# EAGLE schematic ESP32-POV (EAGLE 6.5.0), part 1 of 3
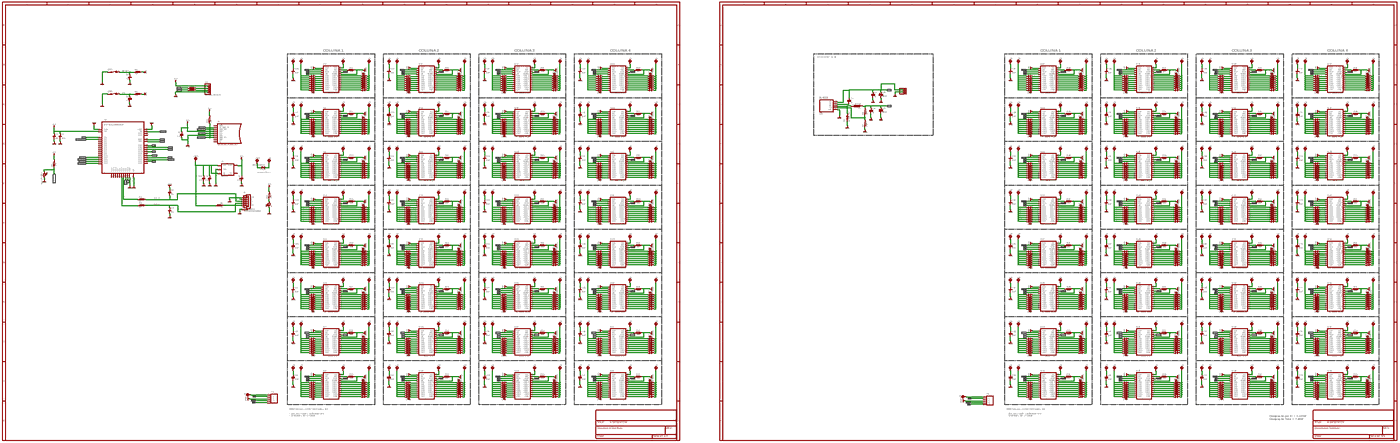
[diagram p0: schematic, sheet 1, overview]
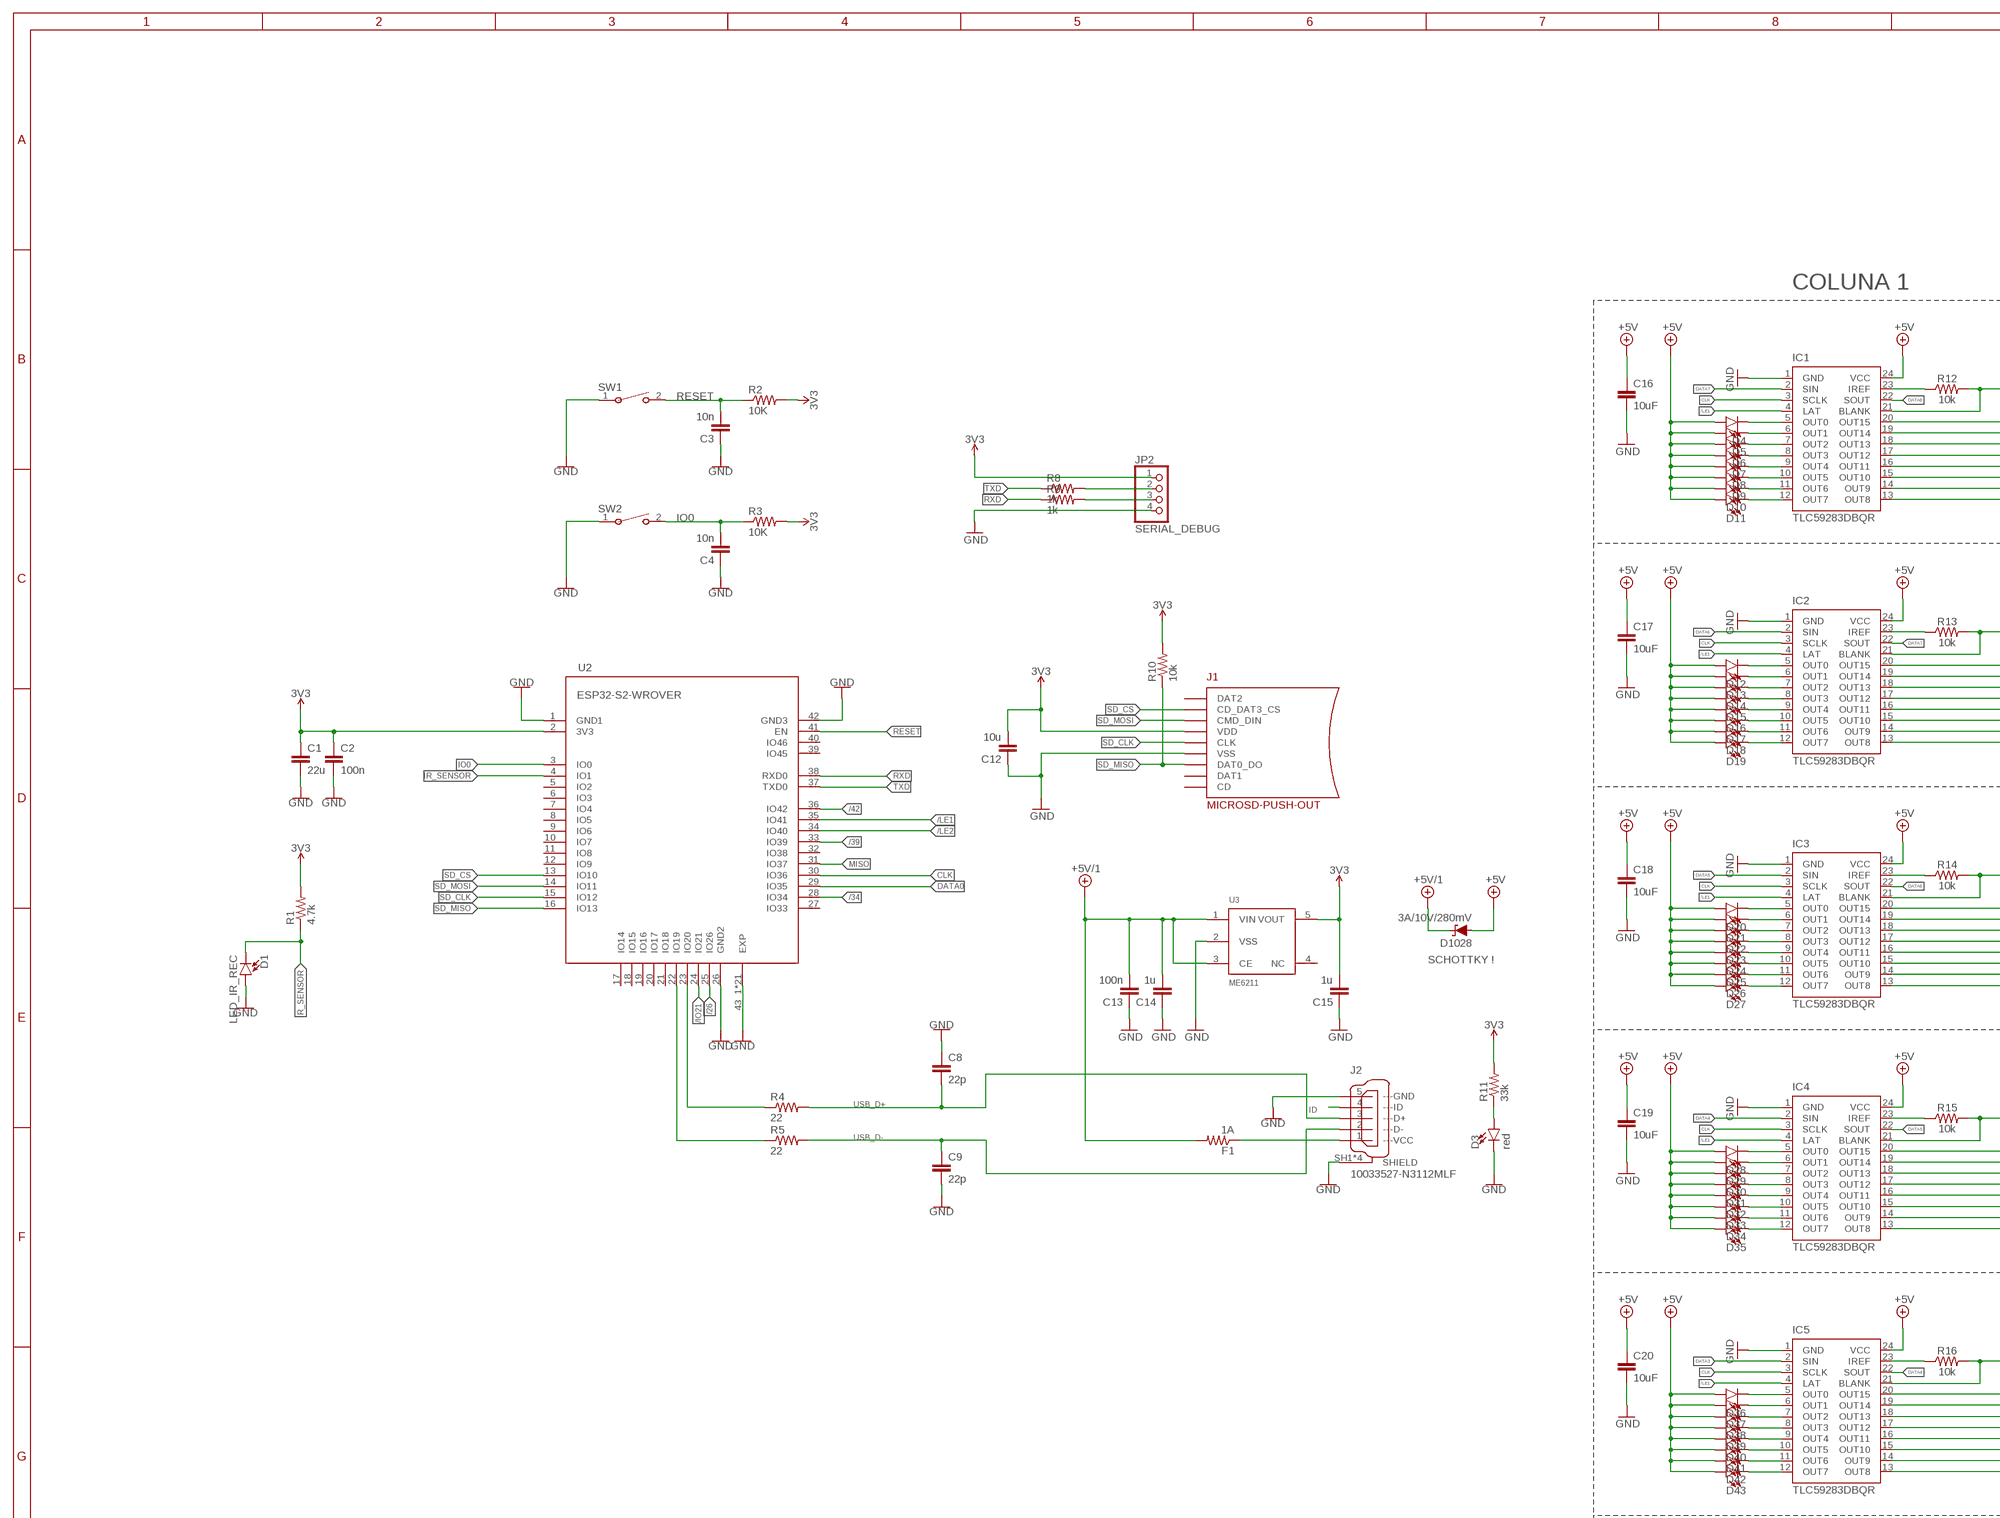
[diagram p1: schematic, sheet 1, part 1 of 8]
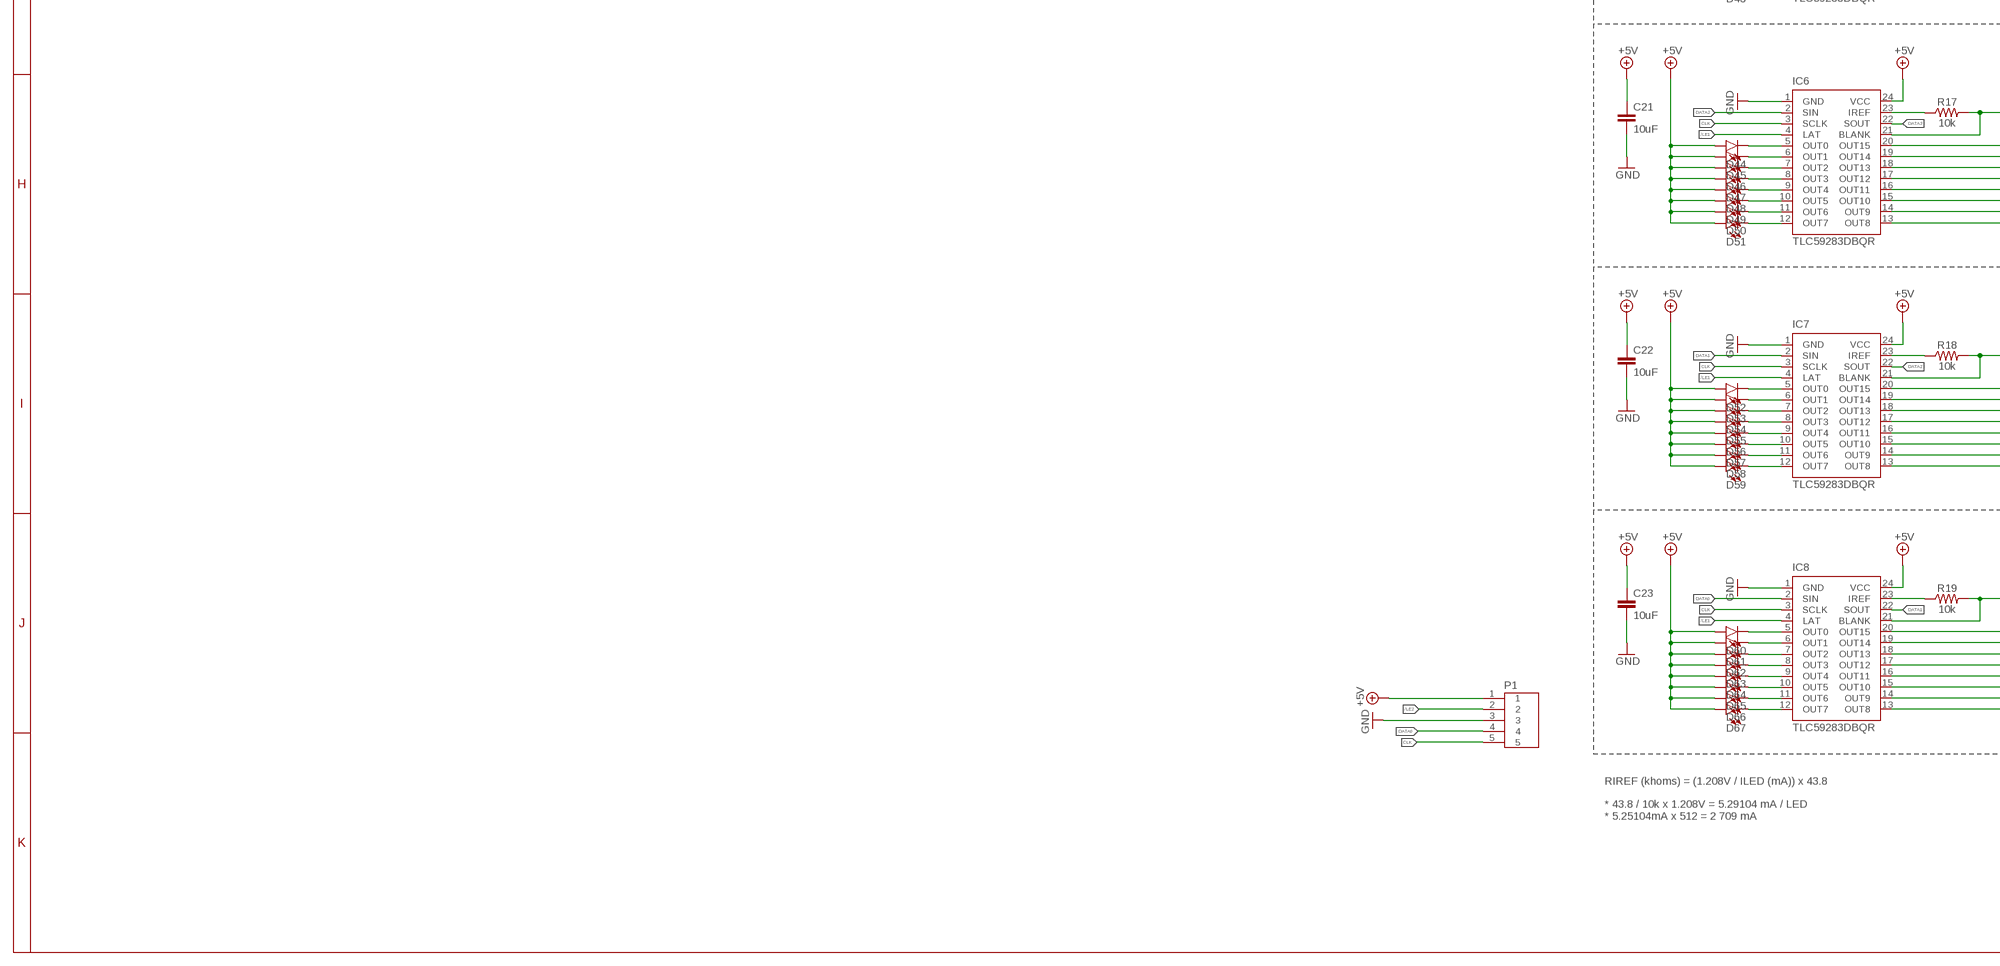
[diagram p2: schematic, sheet 1, part 2 of 8]
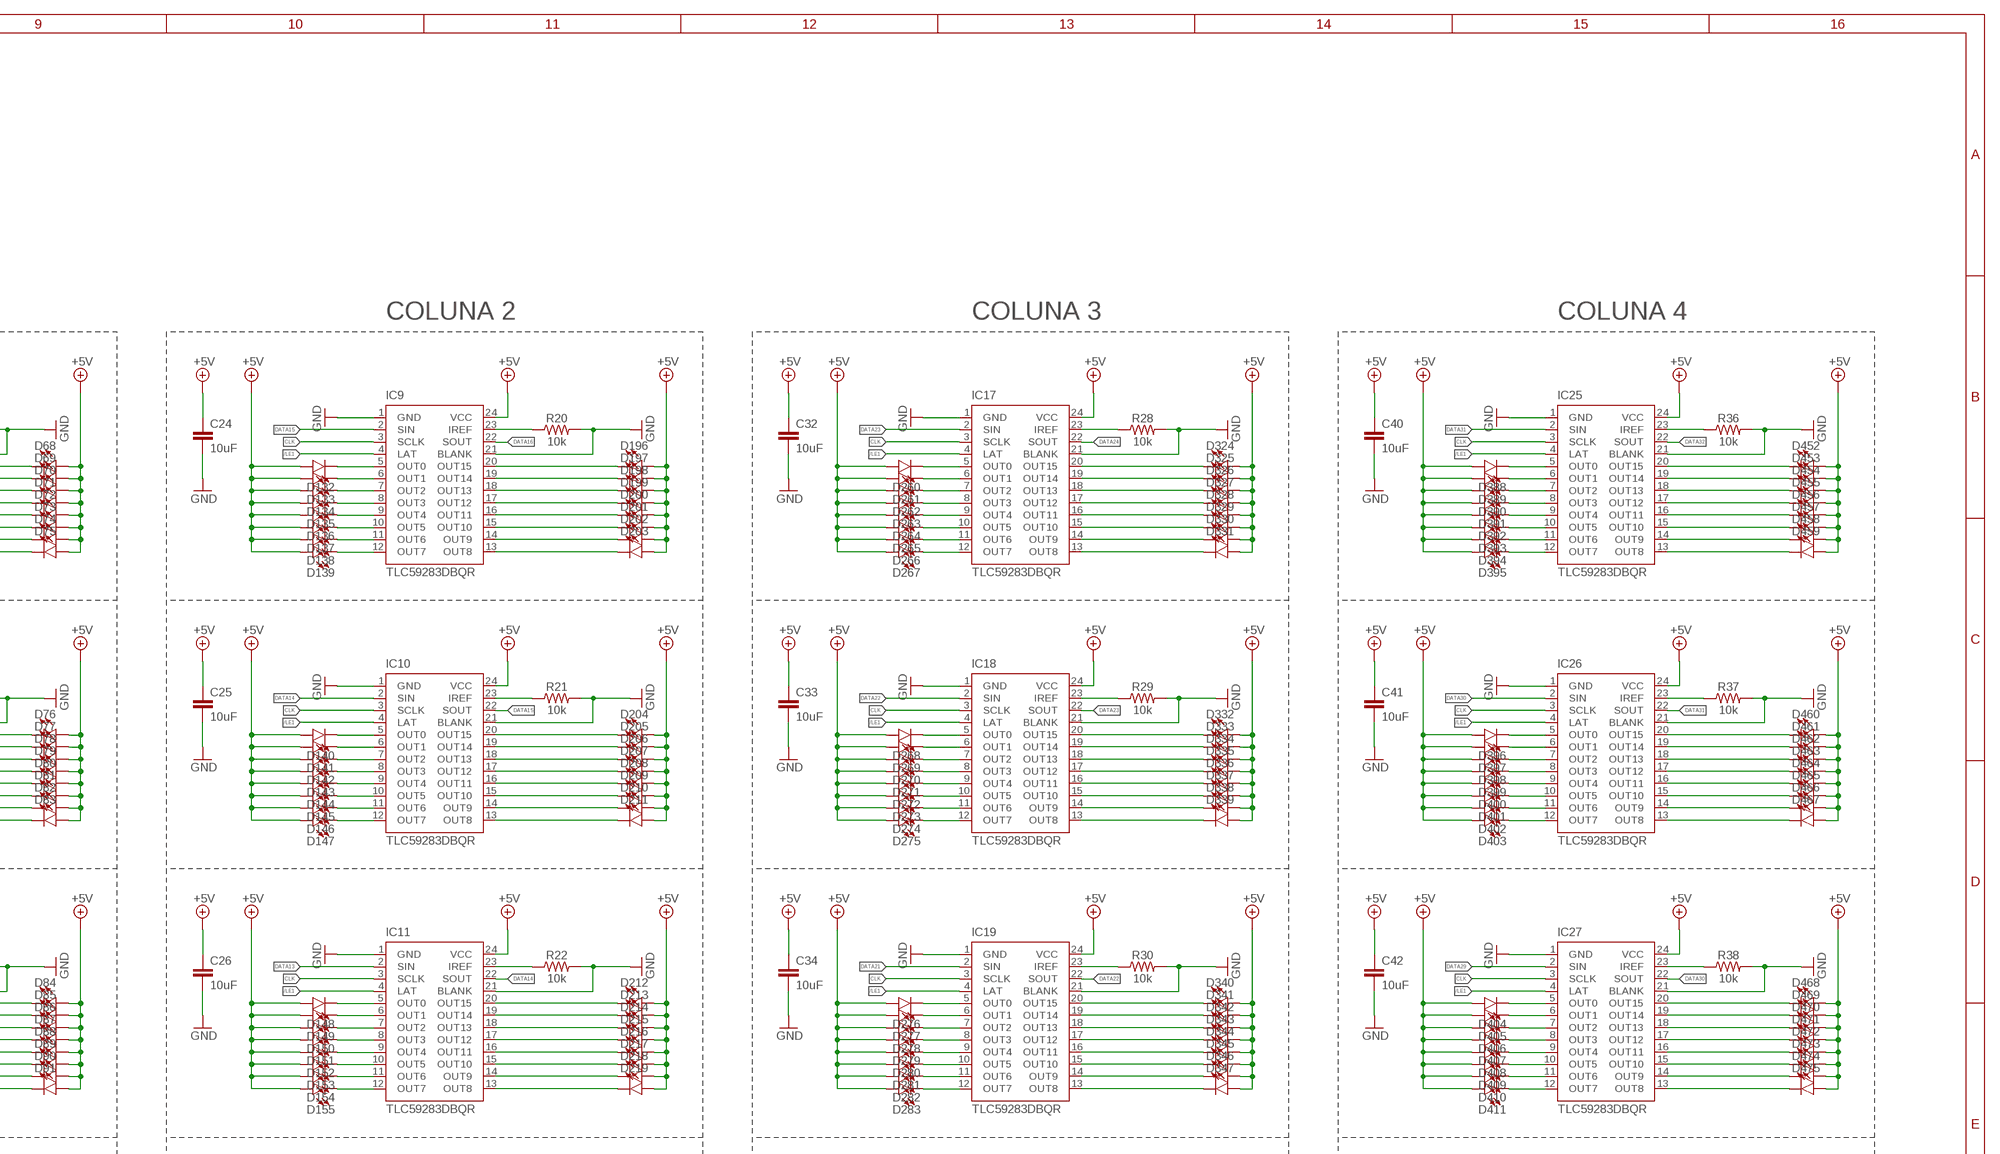
[diagram p3: schematic, sheet 1, part 3 of 8]
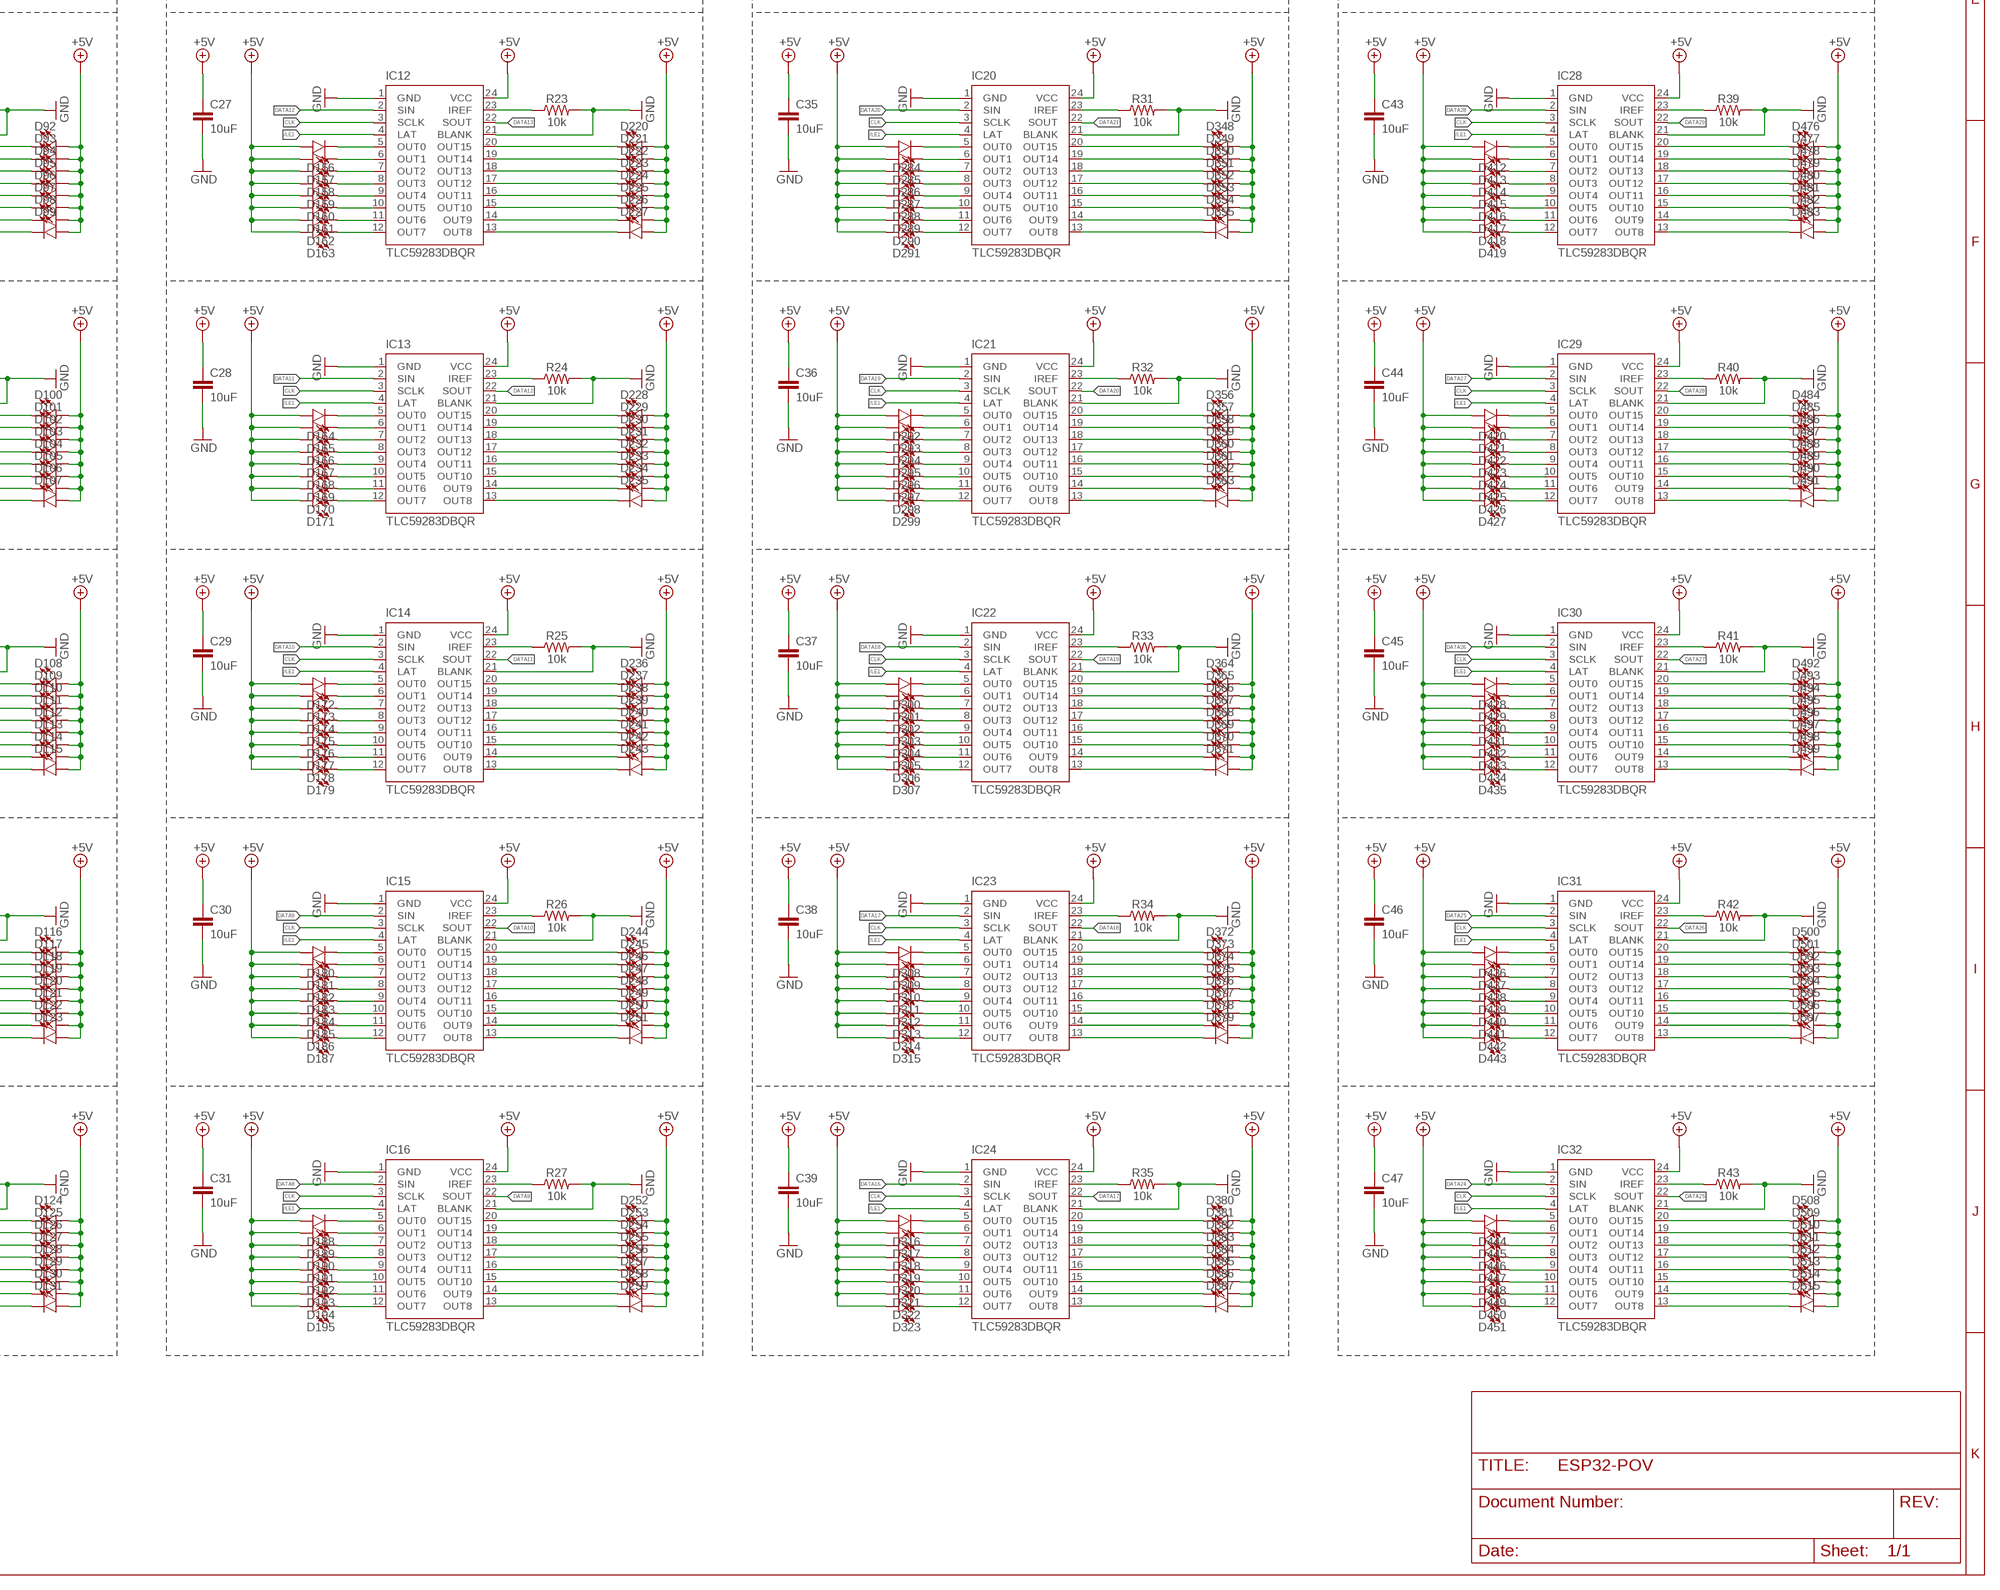
[diagram p4: schematic, sheet 1, part 4 of 8]
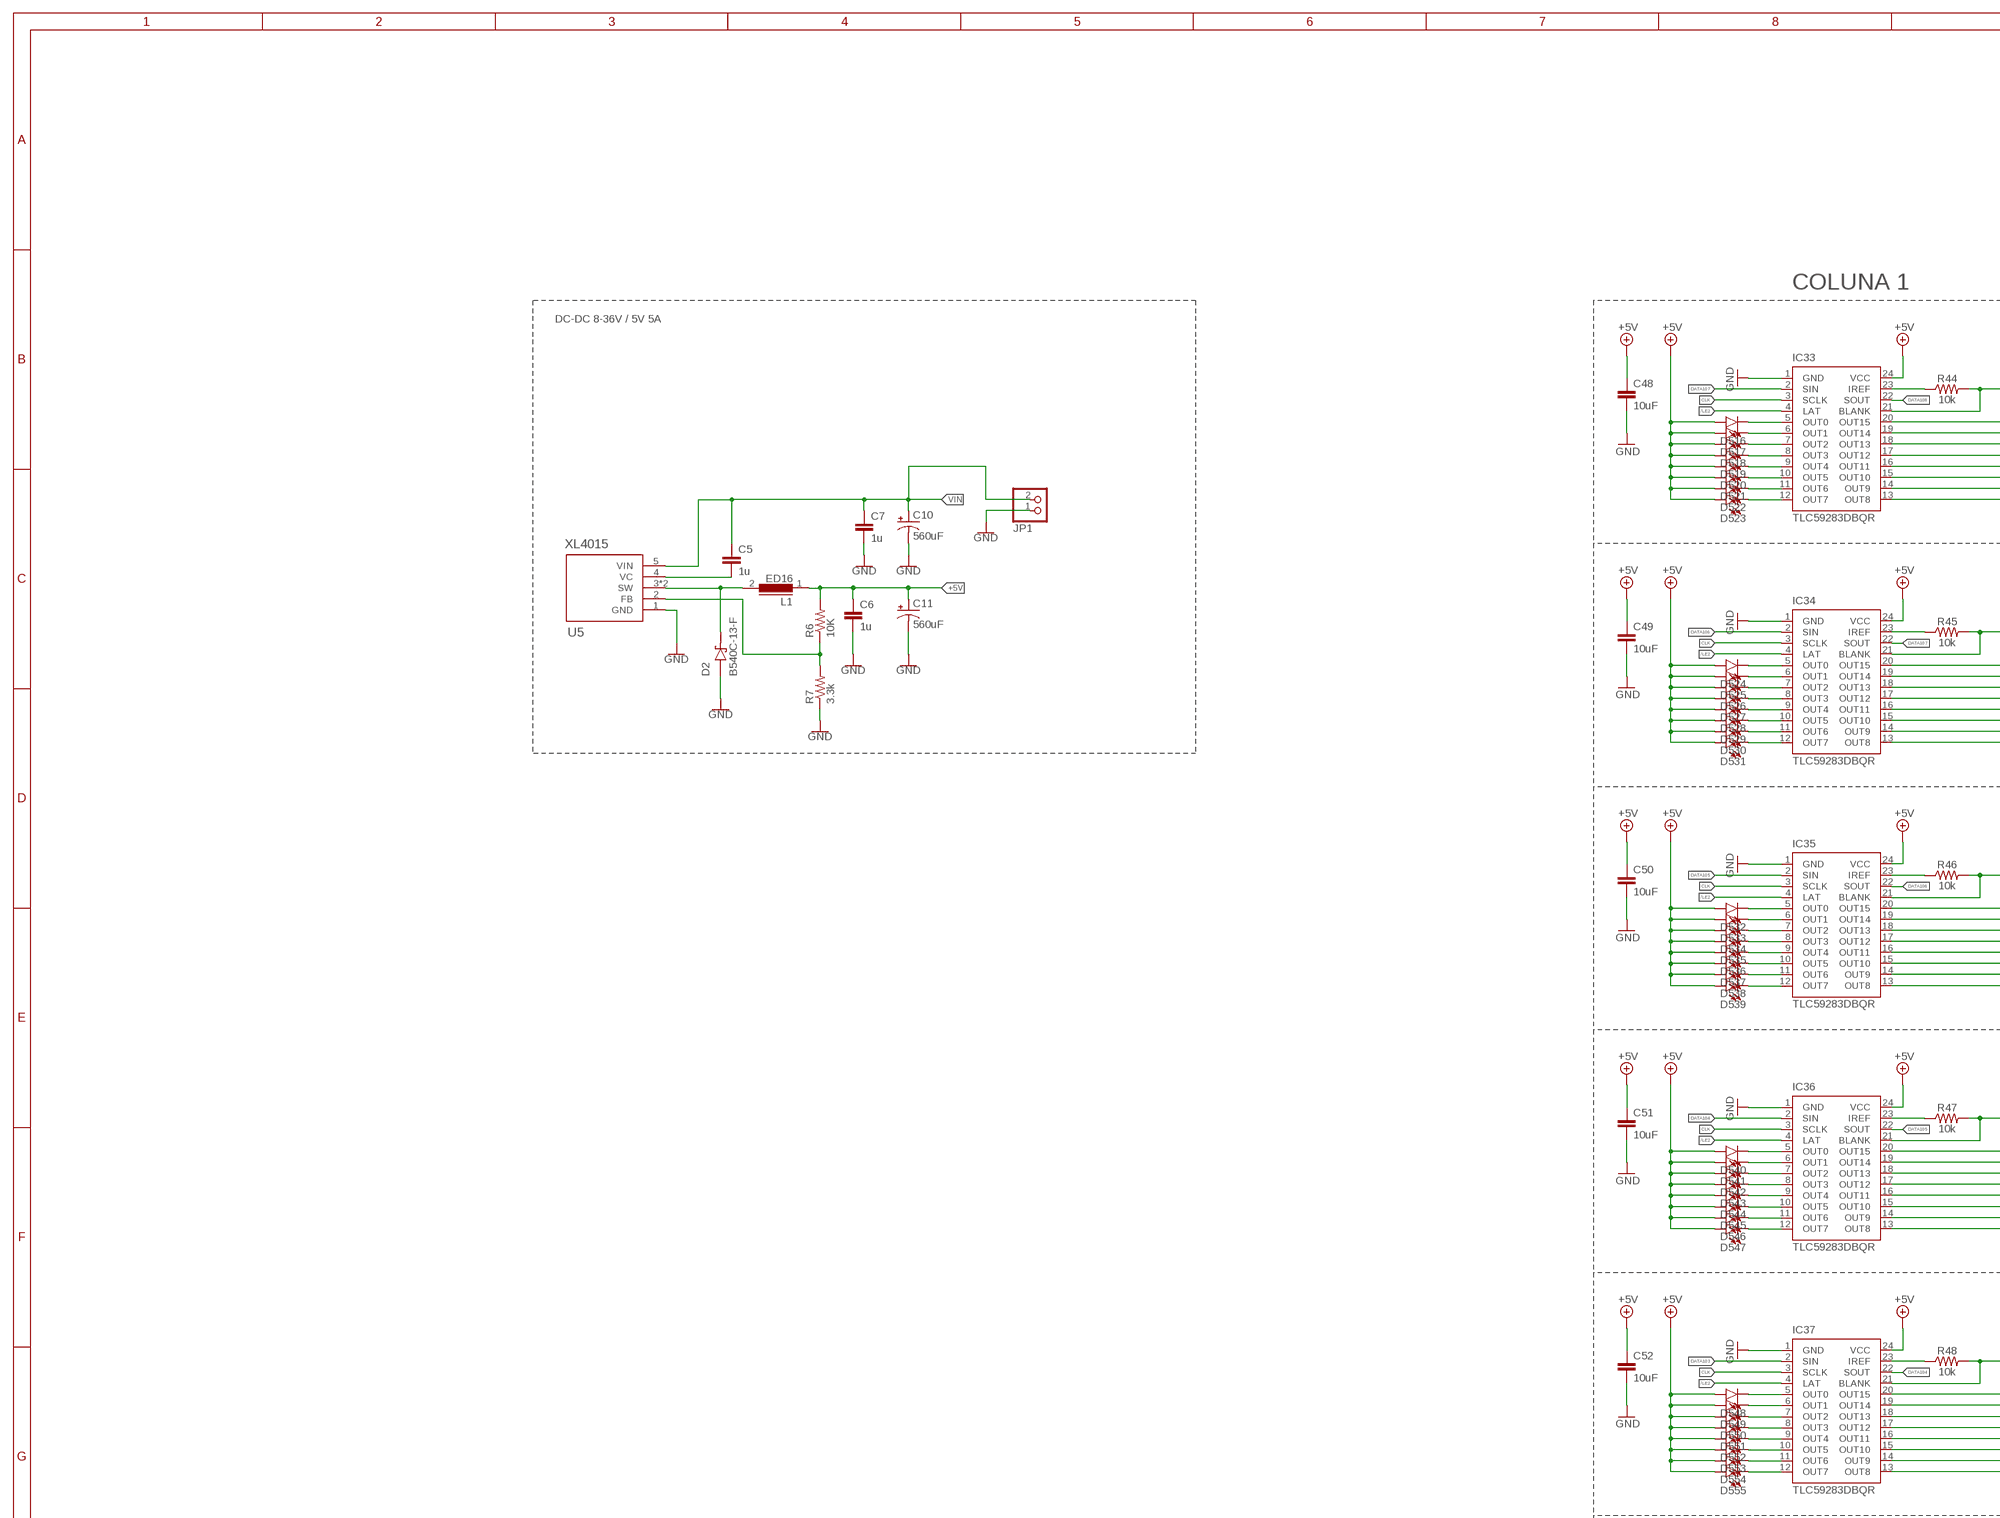
[diagram p5: schematic, sheet 1, part 5 of 8]
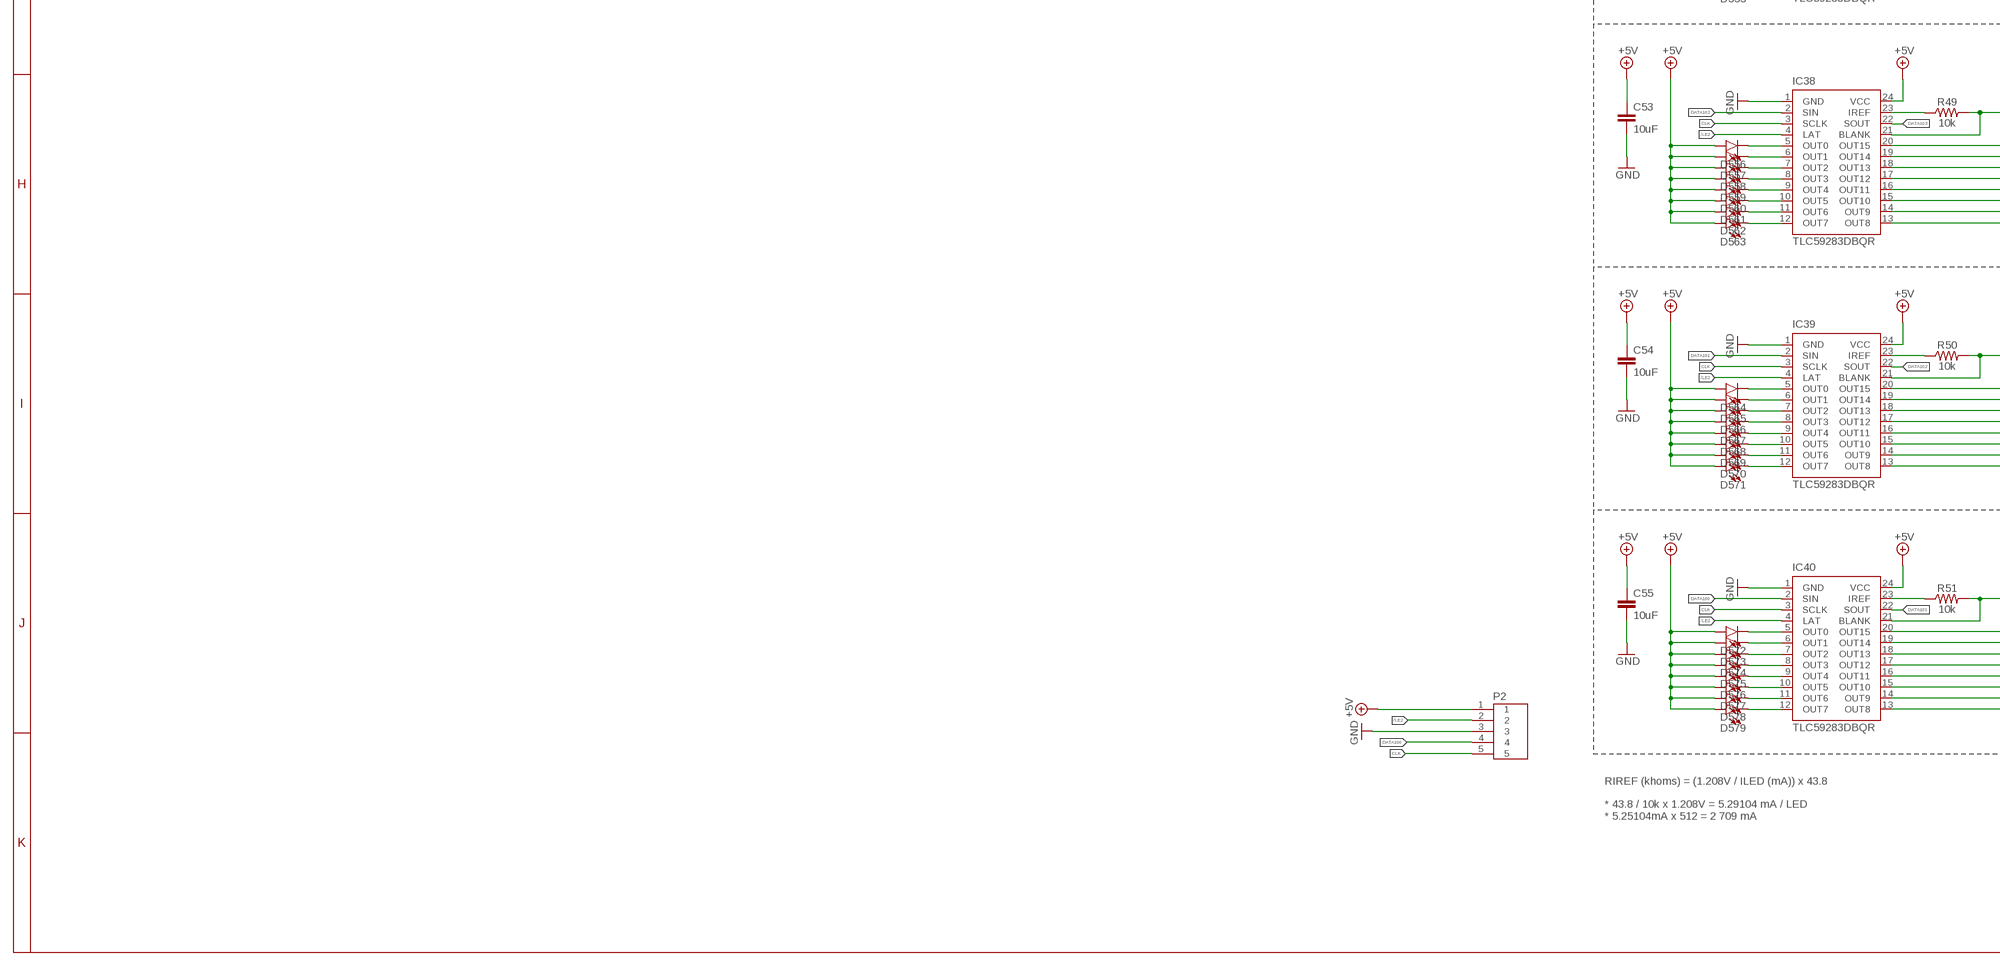
[diagram p6: schematic, sheet 1, part 6 of 8]
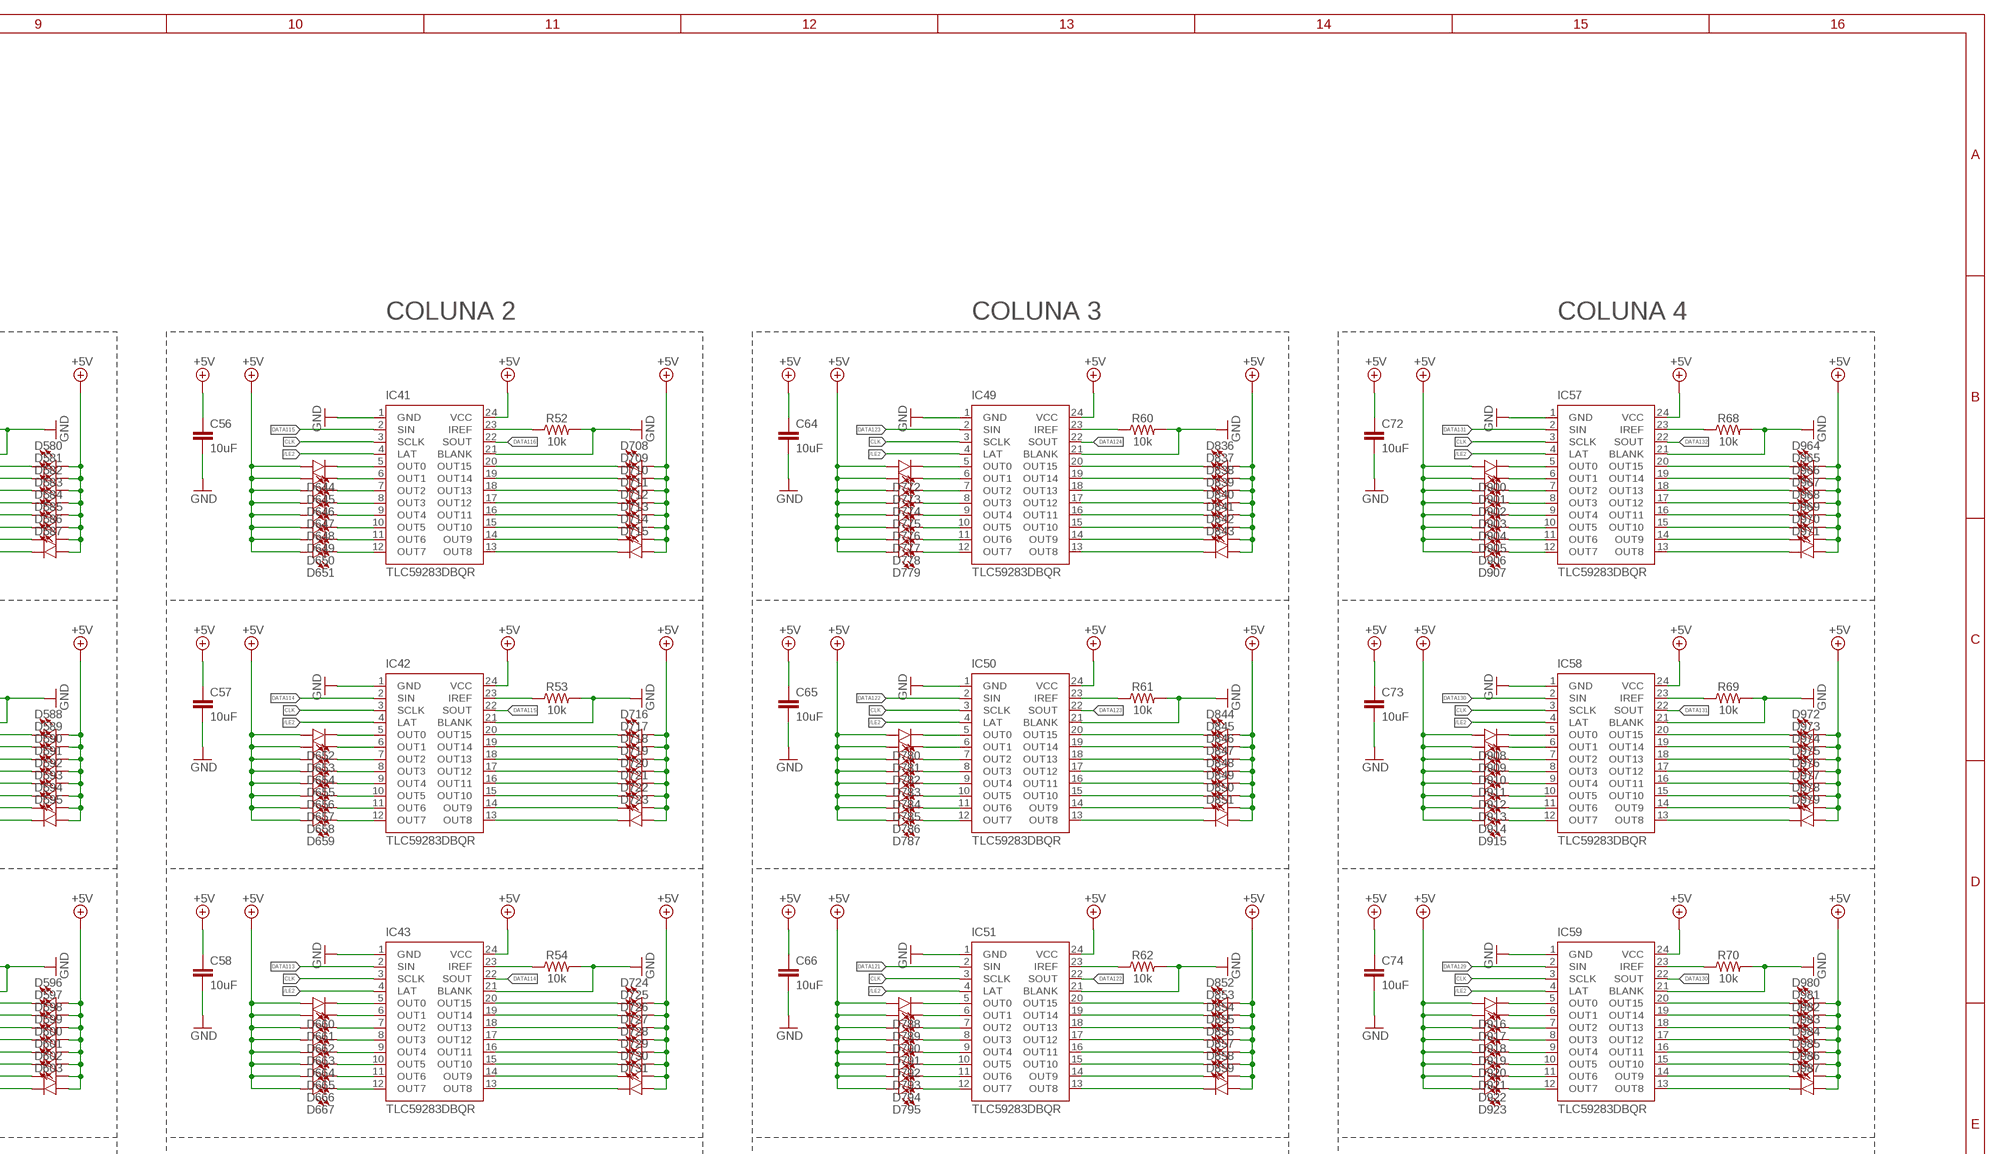
[diagram p7: schematic, sheet 1, part 7 of 8]
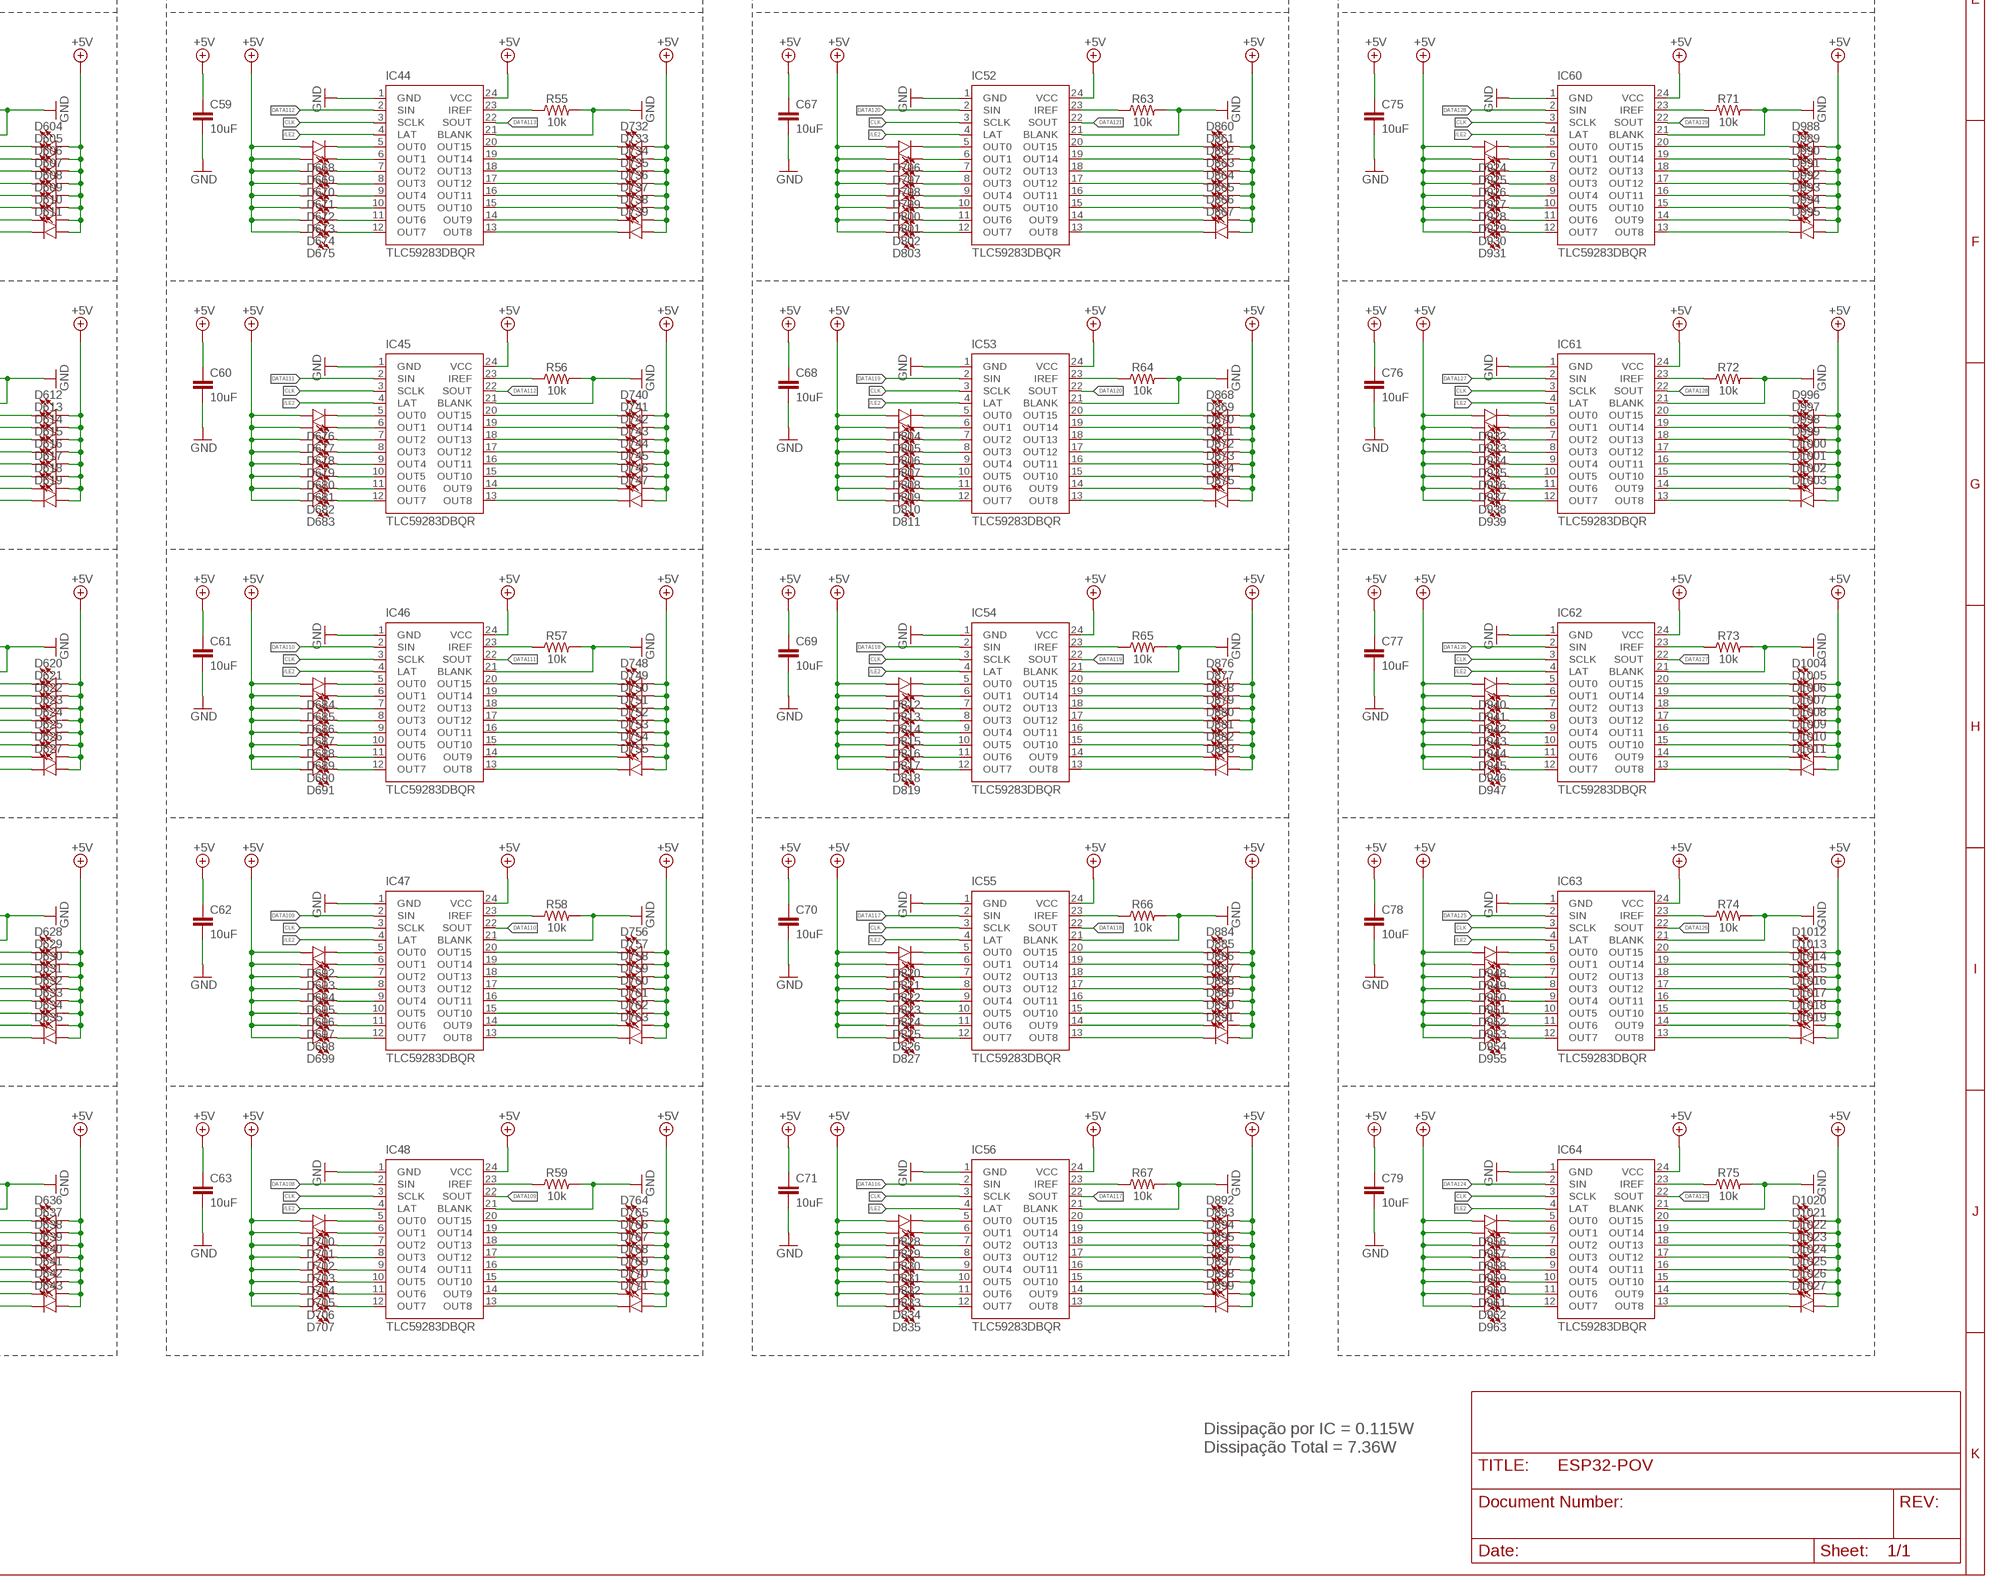
[diagram p8: schematic, sheet 1, part 8 of 8]

## Parts
C1  22u  CAP1206  [1206]
C2  100n  CAP0805  [0805]
C3  10n  CAP0805  [0805]
C4  10n  CAP0805  [0805]
C5  1u  CAP0805  [0805]
C6  1u  CAP0805  [0805]
C7  1u  CAP0805  [0805]
C8  22p  CAP0805  [0805]
C9  22p  CAP0805  [0805]
C10  560uF  560UF-PANASONIC_G-25V-20%  [PANASONIC_G]
C11  560uF  560UF-PANASONIC_G-25V-20%  [PANASONIC_G]
C12  10u  CAP0805  [0805]
C13  100n  CAP0805  [0805]
C14  1u  CAP0805  [0805]
C15  1u  CAP0805  [0805]
C16  10uF  10UF-0603-6.3V-20%  [0603]
C17  10uF  10UF-0603-6.3V-20%  [0603]
C18  10uF  10UF-0603-6.3V-20%  [0603]
C19  10uF  10UF-0603-6.3V-20%  [0603]
C20  10uF  10UF-0603-6.3V-20%  [0603]
C21  10uF  10UF-0603-6.3V-20%  [0603]
C22  10uF  10UF-0603-6.3V-20%  [0603]
C23  10uF  10UF-0603-6.3V-20%  [0603]
C24  10uF  10UF-0603-6.3V-20%  [0603]
C25  10uF  10UF-0603-6.3V-20%  [0603]
C26  10uF  10UF-0603-6.3V-20%  [0603]
C27  10uF  10UF-0603-6.3V-20%  [0603]
C28  10uF  10UF-0603-6.3V-20%  [0603]
C29  10uF  10UF-0603-6.3V-20%  [0603]
C30  10uF  10UF-0603-6.3V-20%  [0603]
C31  10uF  10UF-0603-6.3V-20%  [0603]
C32  10uF  10UF-0603-6.3V-20%  [0603]
C33  10uF  10UF-0603-6.3V-20%  [0603]
C34  10uF  10UF-0603-6.3V-20%  [0603]
C35  10uF  10UF-0603-6.3V-20%  [0603]
C36  10uF  10UF-0603-6.3V-20%  [0603]
C37  10uF  10UF-0603-6.3V-20%  [0603]
C38  10uF  10UF-0603-6.3V-20%  [0603]
C39  10uF  10UF-0603-6.3V-20%  [0603]
C40  10uF  10UF-0603-6.3V-20%  [0603]
C41  10uF  10UF-0603-6.3V-20%  [0603]
C42  10uF  10UF-0603-6.3V-20%  [0603]
C43  10uF  10UF-0603-6.3V-20%  [0603]
C44  10uF  10UF-0603-6.3V-20%  [0603]
C45  10uF  10UF-0603-6.3V-20%  [0603]
C46  10uF  10UF-0603-6.3V-20%  [0603]
C47  10uF  10UF-0603-6.3V-20%  [0603]
C48  10uF  10UF-0603-6.3V-20%  [0603]
C49  10uF  10UF-0603-6.3V-20%  [0603]
C50  10uF  10UF-0603-6.3V-20%  [0603]
C51  10uF  10UF-0603-6.3V-20%  [0603]
C52  10uF  10UF-0603-6.3V-20%  [0603]
C53  10uF  10UF-0603-6.3V-20%  [0603]
C54  10uF  10UF-0603-6.3V-20%  [0603]
C55  10uF  10UF-0603-6.3V-20%  [0603]
C56  10uF  10UF-0603-6.3V-20%  [0603]
C57  10uF  10UF-0603-6.3V-20%  [0603]
C58  10uF  10UF-0603-6.3V-20%  [0603]
C59  10uF  10UF-0603-6.3V-20%  [0603]
C60  10uF  10UF-0603-6.3V-20%  [0603]
C61  10uF  10UF-0603-6.3V-20%  [0603]
C62  10uF  10UF-0603-6.3V-20%  [0603]
C63  10uF  10UF-0603-6.3V-20%  [0603]
C64  10uF  10UF-0603-6.3V-20%  [0603]
C65  10uF  10UF-0603-6.3V-20%  [0603]
C66  10uF  10UF-0603-6.3V-20%  [0603]
C67  10uF  10UF-0603-6.3V-20%  [0603]
C68  10uF  10UF-0603-6.3V-20%  [0603]
C69  10uF  10UF-0603-6.3V-20%  [0603]
C70  10uF  10UF-0603-6.3V-20%  [0603]
C71  10uF  10UF-0603-6.3V-20%  [0603]
C72  10uF  10UF-0603-6.3V-20%  [0603]
C73  10uF  10UF-0603-6.3V-20%  [0603]
C74  10uF  10UF-0603-6.3V-20%  [0603]
C75  10uF  10UF-0603-6.3V-20%  [0603]
C76  10uF  10UF-0603-6.3V-20%  [0603]
C77  10uF  10UF-0603-6.3V-20%  [0603]
C78  10uF  10UF-0603-6.3V-20%  [0603]
C79  10uF  10UF-0603-6.3V-20%  [0603]
D1  LED_IR_REC  [LED_IR_REC]
D2  B540C-13-F  [DIOM6959X245N]
D3  red  LED-RED-0805  [LED-0805]
D4  LED-BLUE0603  [LED-0603]
D5  LED-BLUE0603  [LED-0603]
D6  LED-BLUE0603  [LED-0603]
D7  LED-BLUE0603  [LED-0603]
D8  LED-BLUE0603  [LED-0603]
D9  LED-BLUE0603  [LED-0603]
D10  LED-BLUE0603  [LED-0603]
D11  LED-BLUE0603  [LED-0603]
D12  LED-BLUE0603  [LED-0603]
D13  LED-BLUE0603  [LED-0603]
D14  LED-BLUE0603  [LED-0603]
D15  LED-BLUE0603  [LED-0603]
D16  LED-BLUE0603  [LED-0603]
D17  LED-BLUE0603  [LED-0603]
D18  LED-BLUE0603  [LED-0603]
D19  LED-BLUE0603  [LED-0603]
D20  LED-BLUE0603  [LED-0603]
D21  LED-BLUE0603  [LED-0603]
D22  LED-BLUE0603  [LED-0603]
D23  LED-BLUE0603  [LED-0603]
D24  LED-BLUE0603  [LED-0603]
D25  LED-BLUE0603  [LED-0603]
D26  LED-BLUE0603  [LED-0603]
D27  LED-BLUE0603  [LED-0603]
D28  LED-BLUE0603  [LED-0603]
D29  LED-BLUE0603  [LED-0603]
D30  LED-BLUE0603  [LED-0603]
D31  LED-BLUE0603  [LED-0603]
D32  LED-BLUE0603  [LED-0603]
D33  LED-BLUE0603  [LED-0603]
D34  LED-BLUE0603  [LED-0603]
D35  LED-BLUE0603  [LED-0603]
D36  LED-BLUE0603  [LED-0603]
D37  LED-BLUE0603  [LED-0603]
D38  LED-BLUE0603  [LED-0603]
D39  LED-BLUE0603  [LED-0603]
D40  LED-BLUE0603  [LED-0603]
D41  LED-BLUE0603  [LED-0603]
D42  LED-BLUE0603  [LED-0603]
D43  LED-BLUE0603  [LED-0603]
D44  LED-BLUE0603  [LED-0603]
D45  LED-BLUE0603  [LED-0603]
D46  LED-BLUE0603  [LED-0603]
D47  LED-BLUE0603  [LED-0603]
D48  LED-BLUE0603  [LED-0603]
D49  LED-BLUE0603  [LED-0603]
D50  LED-BLUE0603  [LED-0603]
D51  LED-BLUE0603  [LED-0603]
D52  LED-BLUE0603  [LED-0603]
D53  LED-BLUE0603  [LED-0603]
D54  LED-BLUE0603  [LED-0603]
D55  LED-BLUE0603  [LED-0603]
D56  LED-BLUE0603  [LED-0603]
D57  LED-BLUE0603  [LED-0603]
D58  LED-BLUE0603  [LED-0603]
D59  LED-BLUE0603  [LED-0603]
D60  LED-BLUE0603  [LED-0603]
D61  LED-BLUE0603  [LED-0603]
D62  LED-BLUE0603  [LED-0603]
D63  LED-BLUE0603  [LED-0603]
D64  LED-BLUE0603  [LED-0603]
D65  LED-BLUE0603  [LED-0603]
D66  LED-BLUE0603  [LED-0603]
D67  LED-BLUE0603  [LED-0603]
D68  LED-BLUE0603  [LED-0603]
D69  LED-BLUE0603  [LED-0603]
D70  LED-BLUE0603  [LED-0603]
D71  LED-BLUE0603  [LED-0603]
D72  LED-BLUE0603  [LED-0603]
D73  LED-BLUE0603  [LED-0603]
D74  LED-BLUE0603  [LED-0603]
D75  LED-BLUE0603  [LED-0603]
D76  LED-BLUE0603  [LED-0603]
D77  LED-BLUE0603  [LED-0603]
D78  LED-BLUE0603  [LED-0603]
D79  LED-BLUE0603  [LED-0603]
D80  LED-BLUE0603  [LED-0603]
D81  LED-BLUE0603  [LED-0603]
D82  LED-BLUE0603  [LED-0603]
D83  LED-BLUE0603  [LED-0603]
D84  LED-BLUE0603  [LED-0603]
D85  LED-BLUE0603  [LED-0603]
D86  LED-BLUE0603  [LED-0603]
D87  LED-BLUE0603  [LED-0603]
D88  LED-BLUE0603  [LED-0603]
D89  LED-BLUE0603  [LED-0603]
D90  LED-BLUE0603  [LED-0603]
D91  LED-BLUE0603  [LED-0603]
D92  LED-BLUE0603  [LED-0603]
D93  LED-BLUE0603  [LED-0603]
D94  LED-BLUE0603  [LED-0603]
D95  LED-BLUE0603  [LED-0603]
D96  LED-BLUE0603  [LED-0603]
D97  LED-BLUE0603  [LED-0603]
D98  LED-BLUE0603  [LED-0603]
D99  LED-BLUE0603  [LED-0603]
D100  LED-BLUE0603  [LED-0603]
D101  LED-BLUE0603  [LED-0603]
D102  LED-BLUE0603  [LED-0603]
D103  LED-BLUE0603  [LED-0603]
D104  LED-BLUE0603  [LED-0603]
D105  LED-BLUE0603  [LED-0603]
D106  LED-BLUE0603  [LED-0603]
D107  LED-BLUE0603  [LED-0603]
D108  LED-BLUE0603  [LED-0603]
D109  LED-BLUE0603  [LED-0603]
D110  LED-BLUE0603  [LED-0603]
D111  LED-BLUE0603  [LED-0603]
D112  LED-BLUE0603  [LED-0603]
D113  LED-BLUE0603  [LED-0603]
D114  LED-BLUE0603  [LED-0603]
D115  LED-BLUE0603  [LED-0603]
D116  LED-BLUE0603  [LED-0603]
D117  LED-BLUE0603  [LED-0603]
D118  LED-BLUE0603  [LED-0603]
D119  LED-BLUE0603  [LED-0603]
D120  LED-BLUE0603  [LED-0603]
D121  LED-BLUE0603  [LED-0603]
D122  LED-BLUE0603  [LED-0603]
D123  LED-BLUE0603  [LED-0603]
D124  LED-BLUE0603  [LED-0603]
D125  LED-BLUE0603  [LED-0603]
D126  LED-BLUE0603  [LED-0603]
D127  LED-BLUE0603  [LED-0603]
D128  LED-BLUE0603  [LED-0603]
D129  LED-BLUE0603  [LED-0603]
D130  LED-BLUE0603  [LED-0603]
D131  LED-BLUE0603  [LED-0603]
D132  LED-BLUE0603  [LED-0603]
D133  LED-BLUE0603  [LED-0603]
D134  LED-BLUE0603  [LED-0603]
D135  LED-BLUE0603  [LED-0603]
D136  LED-BLUE0603  [LED-0603]
D137  LED-BLUE0603  [LED-0603]
D138  LED-BLUE0603  [LED-0603]
D139  LED-BLUE0603  [LED-0603]
D140  LED-BLUE0603  [LED-0603]
D141  LED-BLUE0603  [LED-0603]
D142  LED-BLUE0603  [LED-0603]
D143  LED-BLUE0603  [LED-0603]
D144  LED-BLUE0603  [LED-0603]
D145  LED-BLUE0603  [LED-0603]
D146  LED-BLUE0603  [LED-0603]
D147  LED-BLUE0603  [LED-0603]
D148  LED-BLUE0603  [LED-0603]
D149  LED-BLUE0603  [LED-0603]
D150  LED-BLUE0603  [LED-0603]
D151  LED-BLUE0603  [LED-0603]
D152  LED-BLUE0603  [LED-0603]
D153  LED-BLUE0603  [LED-0603]
D154  LED-BLUE0603  [LED-0603]
D155  LED-BLUE0603  [LED-0603]
D156  LED-BLUE0603  [LED-0603]
D157  LED-BLUE0603  [LED-0603]
D158  LED-BLUE0603  [LED-0603]
D159  LED-BLUE0603  [LED-0603]
D160  LED-BLUE0603  [LED-0603]
D161  LED-BLUE0603  [LED-0603]
D162  LED-BLUE0603  [LED-0603]
D163  LED-BLUE0603  [LED-0603]
D164  LED-BLUE0603  [LED-0603]
D165  LED-BLUE0603  [LED-0603]
D166  LED-BLUE0603  [LED-0603]
D167  LED-BLUE0603  [LED-0603]
D168  LED-BLUE0603  [LED-0603]
D169  LED-BLUE0603  [LED-0603]
D170  LED-BLUE0603  [LED-0603]
D171  LED-BLUE0603  [LED-0603]
D172  LED-BLUE0603  [LED-0603]
D173  LED-BLUE0603  [LED-0603]
D174  LED-BLUE0603  [LED-0603]
D175  LED-BLUE0603  [LED-0603]
D176  LED-BLUE0603  [LED-0603]
D177  LED-BLUE0603  [LED-0603]
D178  LED-BLUE0603  [LED-0603]
D179  LED-BLUE0603  [LED-0603]
D180  LED-BLUE0603  [LED-0603]
D181  LED-BLUE0603  [LED-0603]
D182  LED-BLUE0603  [LED-0603]
D183  LED-BLUE0603  [LED-0603]
D184  LED-BLUE0603  [LED-0603]
D185  LED-BLUE0603  [LED-0603]
D186  LED-BLUE0603  [LED-0603]
D187  LED-BLUE0603  [LED-0603]
D188  LED-BLUE0603  [LED-0603]
D189  LED-BLUE0603  [LED-0603]
D190  LED-BLUE0603  [LED-0603]
D191  LED-BLUE0603  [LED-0603]
D192  LED-BLUE0603  [LED-0603]
D193  LED-BLUE0603  [LED-0603]
D194  LED-BLUE0603  [LED-0603]
D195  LED-BLUE0603  [LED-0603]
D196  LED-BLUE0603  [LED-0603]
D197  LED-BLUE0603  [LED-0603]
D198  LED-BLUE0603  [LED-0603]
D199  LED-BLUE0603  [LED-0603]
D200  LED-BLUE0603  [LED-0603]
D201  LED-BLUE0603  [LED-0603]
D202  LED-BLUE0603  [LED-0603]
D203  LED-BLUE0603  [LED-0603]
D204  LED-BLUE0603  [LED-0603]
D205  LED-BLUE0603  [LED-0603]
D206  LED-BLUE0603  [LED-0603]
D207  LED-BLUE0603  [LED-0603]
D208  LED-BLUE0603  [LED-0603]
D209  LED-BLUE0603  [LED-0603]
D210  LED-BLUE0603  [LED-0603]
D211  LED-BLUE0603  [LED-0603]
D212  LED-BLUE0603  [LED-0603]
D213  LED-BLUE0603  [LED-0603]
D214  LED-BLUE0603  [LED-0603]
D215  LED-BLUE0603  [LED-0603]
D216  LED-BLUE0603  [LED-0603]
D217  LED-BLUE0603  [LED-0603]
D218  LED-BLUE0603  [LED-0603]
D219  LED-BLUE0603  [LED-0603]
D220  LED-BLUE0603  [LED-0603]
D221  LED-BLUE0603  [LED-0603]
D222  LED-BLUE0603  [LED-0603]
D223  LED-BLUE0603  [LED-0603]
D224  LED-BLUE0603  [LED-0603]
D225  LED-BLUE0603  [LED-0603]
D226  LED-BLUE0603  [LED-0603]
D227  LED-BLUE0603  [LED-0603]
D228  LED-BLUE0603  [LED-0603]
D229  LED-BLUE0603  [LED-0603]
D230  LED-BLUE0603  [LED-0603]
D231  LED-BLUE0603  [LED-0603]
D232  LED-BLUE0603  [LED-0603]
D233  LED-BLUE0603  [LED-0603]
D234  LED-BLUE0603  [LED-0603]
D235  LED-BLUE0603  [LED-0603]
D236  LED-BLUE0603  [LED-0603]
D237  LED-BLUE0603  [LED-0603]
D238  LED-BLUE0603  [LED-0603]
D239  LED-BLUE0603  [LED-0603]
D240  LED-BLUE0603  [LED-0603]
D241  LED-BLUE0603  [LED-0603]
D242  LED-BLUE0603  [LED-0603]
D243  LED-BLUE0603  [LED-0603]
D244  LED-BLUE0603  [LED-0603]
D245  LED-BLUE0603  [LED-0603]
D246  LED-BLUE0603  [LED-0603]
D247  LED-BLUE0603  [LED-0603]
D248  LED-BLUE0603  [LED-0603]
D249  LED-BLUE0603  [LED-0603]
D250  LED-BLUE0603  [LED-0603]
D251  LED-BLUE0603  [LED-0603]
D252  LED-BLUE0603  [LED-0603]
D253  LED-BLUE0603  [LED-0603]
D254  LED-BLUE0603  [LED-0603]
D255  LED-BLUE0603  [LED-0603]
D256  LED-BLUE0603  [LED-0603]
D257  LED-BLUE0603  [LED-0603]
D258  LED-BLUE0603  [LED-0603]
D259  LED-BLUE0603  [LED-0603]
D260  LED-BLUE0603  [LED-0603]
D261  LED-BLUE0603  [LED-0603]
D262  LED-BLUE0603  [LED-0603]
D263  LED-BLUE0603  [LED-0603]
D264  LED-BLUE0603  [LED-0603]
D265  LED-BLUE0603  [LED-0603]
D266  LED-BLUE0603  [LED-0603]
D267  LED-BLUE0603  [LED-0603]
D268  LED-BLUE0603  [LED-0603]
D269  LED-BLUE0603  [LED-0603]
D270  LED-BLUE0603  [LED-0603]
D271  LED-BLUE0603  [LED-0603]
D272  LED-BLUE0603  [LED-0603]
D273  LED-BLUE0603  [LED-0603]
D274  LED-BLUE0603  [LED-0603]
D275  LED-BLUE0603  [LED-0603]
D276  LED-BLUE0603  [LED-0603]
D277  LED-BLUE0603  [LED-0603]
D278  LED-BLUE0603  [LED-0603]
D279  LED-BLUE0603  [LED-0603]
D280  LED-BLUE0603  [LED-0603]
D281  LED-BLUE0603  [LED-0603]
D282  LED-BLUE0603  [LED-0603]
D283  LED-BLUE0603  [LED-0603]
D284  LED-BLUE0603  [LED-0603]
D285  LED-BLUE0603  [LED-0603]
D286  LED-BLUE0603  [LED-0603]
D287  LED-BLUE0603  [LED-0603]
D288  LED-BLUE0603  [LED-0603]
D289  LED-BLUE0603  [LED-0603]
D290  LED-BLUE0603  [LED-0603]
D291  LED-BLUE0603  [LED-0603]
D292  LED-BLUE0603  [LED-0603]
D293  LED-BLUE0603  [LED-0603]
D294  LED-BLUE0603  [LED-0603]
D295  LED-BLUE0603  [LED-0603]
D296  LED-BLUE0603  [LED-0603]
D297  LED-BLUE0603  [LED-0603]
D298  LED-BLUE0603  [LED-0603]
D299  LED-BLUE0603  [LED-0603]
D300  LED-BLUE0603  [LED-0603]
D301  LED-BLUE0603  [LED-0603]
D302  LED-BLUE0603  [LED-0603]
D303  LED-BLUE0603  [LED-0603]
D304  LED-BLUE0603  [LED-0603]
D305  LED-BLUE0603  [LED-0603]
D306  LED-BLUE0603  [LED-0603]
D307  LED-BLUE0603  [LED-0603]
D308  LED-BLUE0603  [LED-0603]
D309  LED-BLUE0603  [LED-0603]
D310  LED-BLUE0603  [LED-0603]
D311  LED-BLUE0603  [LED-0603]
D312  LED-BLUE0603  [LED-0603]
D313  LED-BLUE0603  [LED-0603]
D314  LED-BLUE0603  [LED-0603]
D315  LED-BLUE0603  [LED-0603]
D316  LED-BLUE0603  [LED-0603]
D317  LED-BLUE0603  [LED-0603]
D318  LED-BLUE0603  [LED-0603]
D319  LED-BLUE0603  [LED-0603]
D320  LED-BLUE0603  [LED-0603]
D321  LED-BLUE0603  [LED-0603]
D322  LED-BLUE0603  [LED-0603]
D323  LED-BLUE0603  [LED-0603]
D324  LED-BLUE0603  [LED-0603]
D325  LED-BLUE0603  [LED-0603]
D326  LED-BLUE0603  [LED-0603]
D327  LED-BLUE0603  [LED-0603]
D328  LED-BLUE0603  [LED-0603]
D329  LED-BLUE0603  [LED-0603]
D330  LED-BLUE0603  [LED-0603]
D331  LED-BLUE0603  [LED-0603]
D332  LED-BLUE0603  [LED-0603]
D333  LED-BLUE0603  [LED-0603]
D334  LED-BLUE0603  [LED-0603]
D335  LED-BLUE0603  [LED-0603]
D336  LED-BLUE0603  [LED-0603]
D337  LED-BLUE0603  [LED-0603]
D338  LED-BLUE0603  [LED-0603]
D339  LED-BLUE0603  [LED-0603]
D340  LED-BLUE0603  [LED-0603]
D341  LED-BLUE0603  [LED-0603]
D342  LED-BLUE0603  [LED-0603]
D343  LED-BLUE0603  [LED-0603]
D344  LED-BLUE0603  [LED-0603]
D345  LED-BLUE0603  [LED-0603]
D346  LED-BLUE0603  [LED-0603]
D347  LED-BLUE0603  [LED-0603]
D348  LED-BLUE0603  [LED-0603]
D349  LED-BLUE0603  [LED-0603]
D350  LED-BLUE0603  [LED-0603]
D351  LED-BLUE0603  [LED-0603]
D352  LED-BLUE0603  [LED-0603]
D353  LED-BLUE0603  [LED-0603]
D354  LED-BLUE0603  [LED-0603]
D355  LED-BLUE0603  [LED-0603]
D356  LED-BLUE0603  [LED-0603]
D357  LED-BLUE0603  [LED-0603]
D358  LED-BLUE0603  [LED-0603]
D359  LED-BLUE0603  [LED-0603]
D360  LED-BLUE0603  [LED-0603]
D361  LED-BLUE0603  [LED-0603]
D362  LED-BLUE0603  [LED-0603]
D363  LED-BLUE0603  [LED-0603]
D364  LED-BLUE0603  [LED-0603]
D365  LED-BLUE0603  [LED-0603]
D366  LED-BLUE0603  [LED-0603]
D367  LED-BLUE0603  [LED-0603]
D368  LED-BLUE0603  [LED-0603]
D369  LED-BLUE0603  [LED-0603]
D370  LED-BLUE0603  [LED-0603]
D371  LED-BLUE0603  [LED-0603]
D372  LED-BLUE0603  [LED-0603]
D373  LED-BLUE0603  [LED-0603]
D374  LED-BLUE0603  [LED-0603]
D375  LED-BLUE0603  [LED-0603]
D376  LED-BLUE0603  [LED-0603]
D377  LED-BLUE0603  [LED-0603]
D378  LED-BLUE0603  [LED-0603]
D379  LED-BLUE0603  [LED-0603]
D380  LED-BLUE0603  [LED-0603]
D381  LED-BLUE0603  [LED-0603]
D382  LED-BLUE0603  [LED-0603]
D383  LED-BLUE0603  [LED-0603]
D384  LED-BLUE0603  [LED-0603]
D385  LED-BLUE0603  [LED-0603]
D386  LED-BLUE0603  [LED-0603]
D387  LED-BLUE0603  [LED-0603]
D388  LED-BLUE0603  [LED-0603]
D389  LED-BLUE0603  [LED-0603]
D390  LED-BLUE0603  [LED-0603]
D391  LED-BLUE0603  [LED-0603]
D392  LED-BLUE0603  [LED-0603]
D393  LED-BLUE0603  [LED-0603]
D394  LED-BLUE0603  [LED-0603]
D395  LED-BLUE0603  [LED-0603]
D396  LED-BLUE0603  [LED-0603]
D397  LED-BLUE0603  [LED-0603]
D398  LED-BLUE0603  [LED-0603]
D399  LED-BLUE0603  [LED-0603]
D400  LED-BLUE0603  [LED-0603]
D401  LED-BLUE0603  [LED-0603]
D402  LED-BLUE0603  [LED-0603]
D403  LED-BLUE0603  [LED-0603]
D404  LED-BLUE0603  [LED-0603]
D405  LED-BLUE0603  [LED-0603]
D406  LED-BLUE0603  [LED-0603]
D407  LED-BLUE0603  [LED-0603]
D408  LED-BLUE0603  [LED-0603]
D409  LED-BLUE0603  [LED-0603]
D410  LED-BLUE0603  [LED-0603]
D411  LED-BLUE0603  [LED-0603]
D412  LED-BLUE0603  [LED-0603]
D413  LED-BLUE0603  [LED-0603]
D414  LED-BLUE0603  [LED-0603]
D415  LED-BLUE0603  [LED-0603]
D416  LED-BLUE0603  [LED-0603]
D417  LED-BLUE0603  [LED-0603]
D418  LED-BLUE0603  [LED-0603]
D419  LED-BLUE0603  [LED-0603]
D420  LED-BLUE0603  [LED-0603]
D421  LED-BLUE0603  [LED-0603]
D422  LED-BLUE0603  [LED-0603]
D423  LED-BLUE0603  [LED-0603]
D424  LED-BLUE0603  [LED-0603]
D425  LED-BLUE0603  [LED-0603]
D426  LED-BLUE0603  [LED-0603]
D427  LED-BLUE0603  [LED-0603]
D428  LED-BLUE0603  [LED-0603]
D429  LED-BLUE0603  [LED-0603]
D430  LED-BLUE0603  [LED-0603]
D431  LED-BLUE0603  [LED-0603]
D432  LED-BLUE0603  [LED-0603]
D433  LED-BLUE0603  [LED-0603]
D434  LED-BLUE0603  [LED-0603]
D435  LED-BLUE0603  [LED-0603]
D436  LED-BLUE0603  [LED-0603]
D437  LED-BLUE0603  [LED-0603]
D438  LED-BLUE0603  [LED-0603]
D439  LED-BLUE0603  [LED-0603]
D440  LED-BLUE0603  [LED-0603]
D441  LED-BLUE0603  [LED-0603]
D442  LED-BLUE0603  [LED-0603]
D443  LED-BLUE0603  [LED-0603]
D444  LED-BLUE0603  [LED-0603]
D445  LED-BLUE0603  [LED-0603]
D446  LED-BLUE0603  [LED-0603]
D447  LED-BLUE0603  [LED-0603]
D448  LED-BLUE0603  [LED-0603]
D449  LED-BLUE0603  [LED-0603]
D450  LED-BLUE0603  [LED-0603]
D451  LED-BLUE0603  [LED-0603]
D452  LED-BLUE0603  [LED-0603]
D453  LED-BLUE0603  [LED-0603]
D454  LED-BLUE0603  [LED-0603]
D455  LED-BLUE0603  [LED-0603]
D456  LED-BLUE0603  [LED-0603]
D457  LED-BLUE0603  [LED-0603]
D458  LED-BLUE0603  [LED-0603]
D459  LED-BLUE0603  [LED-0603]
D460  LED-BLUE0603  [LED-0603]
D461  LED-BLUE0603  [LED-0603]
D462  LED-BLUE0603  [LED-0603]
D463  LED-BLUE0603  [LED-0603]
D464  LED-BLUE0603  [LED-0603]
D465  LED-BLUE0603  [LED-0603]
D466  LED-BLUE0603  [LED-0603]
D467  LED-BLUE0603  [LED-0603]
D468  LED-BLUE0603  [LED-0603]
D469  LED-BLUE0603  [LED-0603]
D470  LED-BLUE0603  [LED-0603]
D471  LED-BLUE0603  [LED-0603]
D472  LED-BLUE0603  [LED-0603]
D473  LED-BLUE0603  [LED-0603]
D474  LED-BLUE0603  [LED-0603]
D475  LED-BLUE0603  [LED-0603]
D476  LED-BLUE0603  [LED-0603]
D477  LED-BLUE0603  [LED-0603]
D478  LED-BLUE0603  [LED-0603]
D479  LED-BLUE0603  [LED-0603]
D480  LED-BLUE0603  [LED-0603]
D481  LED-BLUE0603  [LED-0603]
D482  LED-BLUE0603  [LED-0603]
D483  LED-BLUE0603  [LED-0603]
D484  LED-BLUE0603  [LED-0603]
D485  LED-BLUE0603  [LED-0603]
D486  LED-BLUE0603  [LED-0603]
D487  LED-BLUE0603  [LED-0603]
D488  LED-BLUE0603  [LED-0603]
D489  LED-BLUE0603  [LED-0603]
D490  LED-BLUE0603  [LED-0603]
D491  LED-BLUE0603  [LED-0603]
D492  LED-BLUE0603  [LED-0603]
D493  LED-BLUE0603  [LED-0603]
D494  LED-BLUE0603  [LED-0603]
D495  LED-BLUE0603  [LED-0603]
D496  LED-BLUE0603  [LED-0603]
D497  LED-BLUE0603  [LED-0603]
D498  LED-BLUE0603  [LED-0603]
D499  LED-BLUE0603  [LED-0603]
D500  LED-BLUE0603  [LED-0603]
D501  LED-BLUE0603  [LED-0603]
D502  LED-BLUE0603  [LED-0603]
D503  LED-BLUE0603  [LED-0603]
D504  LED-BLUE0603  [LED-0603]
D505  LED-BLUE0603  [LED-0603]
D506  LED-BLUE0603  [LED-0603]
D507  LED-BLUE0603  [LED-0603]
D508  LED-BLUE0603  [LED-0603]
D509  LED-BLUE0603  [LED-0603]
D510  LED-BLUE0603  [LED-0603]
D511  LED-BLUE0603  [LED-0603]
D512  LED-BLUE0603  [LED-0603]
D513  LED-BLUE0603  [LED-0603]
D514  LED-BLUE0603  [LED-0603]
D515  LED-BLUE0603  [LED-0603]
D516  LED-BLUE0603  [LED-0603]
D517  LED-BLUE0603  [LED-0603]
D518  LED-BLUE0603  [LED-0603]
D519  LED-BLUE0603  [LED-0603]
D520  LED-BLUE0603  [LED-0603]
D521  LED-BLUE0603  [LED-0603]
D522  LED-BLUE0603  [LED-0603]
D523  LED-BLUE0603  [LED-0603]
D524  LED-BLUE0603  [LED-0603]
D525  LED-BLUE0603  [LED-0603]
D526  LED-BLUE0603  [LED-0603]
D527  LED-BLUE0603  [LED-0603]
D528  LED-BLUE0603  [LED-0603]
D529  LED-BLUE0603  [LED-0603]
D530  LED-BLUE0603  [LED-0603]
D531  LED-BLUE0603  [LED-0603]
D532  LED-BLUE0603  [LED-0603]
D533  LED-BLUE0603  [LED-0603]
D534  LED-BLUE0603  [LED-0603]
D535  LED-BLUE0603  [LED-0603]
D536  LED-BLUE0603  [LED-0603]
D537  LED-BLUE0603  [LED-0603]
D538  LED-BLUE0603  [LED-0603]
D539  LED-BLUE0603  [LED-0603]
D540  LED-BLUE0603  [LED-0603]
D541  LED-BLUE0603  [LED-0603]
D542  LED-BLUE0603  [LED-0603]
D543  LED-BLUE0603  [LED-0603]
D544  LED-BLUE0603  [LED-0603]
D545  LED-BLUE0603  [LED-0603]
D546  LED-BLUE0603  [LED-0603]
D547  LED-BLUE0603  [LED-0603]
D548  LED-BLUE0603  [LED-0603]
D549  LED-BLUE0603  [LED-0603]
D550  LED-BLUE0603  [LED-0603]
D551  LED-BLUE0603  [LED-0603]
D552  LED-BLUE0603  [LED-0603]
D553  LED-BLUE0603  [LED-0603]
D554  LED-BLUE0603  [LED-0603]
D555  LED-BLUE0603  [LED-0603]
D556  LED-BLUE0603  [LED-0603]
D557  LED-BLUE0603  [LED-0603]
D558  LED-BLUE0603  [LED-0603]
D559  LED-BLUE0603  [LED-0603]
D560  LED-BLUE0603  [LED-0603]
D561  LED-BLUE0603  [LED-0603]
D562  LED-BLUE0603  [LED-0603]
D563  LED-BLUE0603  [LED-0603]
D564  LED-BLUE0603  [LED-0603]
D565  LED-BLUE0603  [LED-0603]
D566  LED-BLUE0603  [LED-0603]
D567  LED-BLUE0603  [LED-0603]
D568  LED-BLUE0603  [LED-0603]
D569  LED-BLUE0603  [LED-0603]
D570  LED-BLUE0603  [LED-0603]
D571  LED-BLUE0603  [LED-0603]
D572  LED-BLUE0603  [LED-0603]
D573  LED-BLUE0603  [LED-0603]
D574  LED-BLUE0603  [LED-0603]
D575  LED-BLUE0603  [LED-0603]
D576  LED-BLUE0603  [LED-0603]
D577  LED-BLUE0603  [LED-0603]
D578  LED-BLUE0603  [LED-0603]
D579  LED-BLUE0603  [LED-0603]
D580  LED-BLUE0603  [LED-0603]
D581  LED-BLUE0603  [LED-0603]
D582  LED-BLUE0603  [LED-0603]
D583  LED-BLUE0603  [LED-0603]
D584  LED-BLUE0603  [LED-0603]
D585  LED-BLUE0603  [LED-0603]
D586  LED-BLUE0603  [LED-0603]
D587  LED-BLUE0603  [LED-0603]
D588  LED-BLUE0603  [LED-0603]
D589  LED-BLUE0603  [LED-0603]
D590  LED-BLUE0603  [LED-0603]
D591  LED-BLUE0603  [LED-0603]
D592  LED-BLUE0603  [LED-0603]
D593  LED-BLUE0603  [LED-0603]
D594  LED-BLUE0603  [LED-0603]
D595  LED-BLUE0603  [LED-0603]
D596  LED-BLUE0603  [LED-0603]
D597  LED-BLUE0603  [LED-0603]
D598  LED-BLUE0603  [LED-0603]
D599  LED-BLUE0603  [LED-0603]
D600  LED-BLUE0603  [LED-0603]
D601  LED-BLUE0603  [LED-0603]
D602  LED-BLUE0603  [LED-0603]
D603  LED-BLUE0603  [LED-0603]
D604  LED-BLUE0603  [LED-0603]
D605  LED-BLUE0603  [LED-0603]
D606  LED-BLUE0603  [LED-0603]
D607  LED-BLUE0603  [LED-0603]
D608  LED-BLUE0603  [LED-0603]
D609  LED-BLUE0603  [LED-0603]
D610  LED-BLUE0603  [LED-0603]
D611  LED-BLUE0603  [LED-0603]
D612  LED-BLUE0603  [LED-0603]
D613  LED-BLUE0603  [LED-0603]
D614  LED-BLUE0603  [LED-0603]
D615  LED-BLUE0603  [LED-0603]
D616  LED-BLUE0603  [LED-0603]
D617  LED-BLUE0603  [LED-0603]
D618  LED-BLUE0603  [LED-0603]
D619  LED-BLUE0603  [LED-0603]
D620  LED-BLUE0603  [LED-0603]
D621  LED-BLUE0603  [LED-0603]
D622  LED-BLUE0603  [LED-0603]
D623  LED-BLUE0603  [LED-0603]
D624  LED-BLUE0603  [LED-0603]
D625  LED-BLUE0603  [LED-0603]
D626  LED-BLUE0603  [LED-0603]
D627  LED-BLUE0603  [LED-0603]
D628  LED-BLUE0603  [LED-0603]
D629  LED-BLUE0603  [LED-0603]
D630  LED-BLUE0603  [LED-0603]
D631  LED-BLUE0603  [LED-0603]
D632  LED-BLUE0603  [LED-0603]
D633  LED-BLUE0603  [LED-0603]
D634  LED-BLUE0603  [LED-0603]
D635  LED-BLUE0603  [LED-0603]
D636  LED-BLUE0603  [LED-0603]
D637  LED-BLUE0603  [LED-0603]
D638  LED-BLUE0603  [LED-0603]
D639  LED-BLUE0603  [LED-0603]
D640  LED-BLUE0603  [LED-0603]
D641  LED-BLUE0603  [LED-0603]
D642  LED-BLUE0603  [LED-0603]
D643  LED-BLUE0603  [LED-0603]
D644  LED-BLUE0603  [LED-0603]
D645  LED-BLUE0603  [LED-0603]
D646  LED-BLUE0603  [LED-0603]
D647  LED-BLUE0603  [LED-0603]
D648  LED-BLUE0603  [LED-0603]
D649  LED-BLUE0603  [LED-0603]
D650  LED-BLUE0603  [LED-0603]
D651  LED-BLUE0603  [LED-0603]
D652  LED-BLUE0603  [LED-0603]
D653  LED-BLUE0603  [LED-0603]
D654  LED-BLUE0603  [LED-0603]
D655  LED-BLUE0603  [LED-0603]
D656  LED-BLUE0603  [LED-0603]
D657  LED-BLUE0603  [LED-0603]
D658  LED-BLUE0603  [LED-0603]
D659  LED-BLUE0603  [LED-0603]
D660  LED-BLUE0603  [LED-0603]
D661  LED-BLUE0603  [LED-0603]
D662  LED-BLUE0603  [LED-0603]
D663  LED-BLUE0603  [LED-0603]
D664  LED-BLUE0603  [LED-0603]
D665  LED-BLUE0603  [LED-0603]
D666  LED-BLUE0603  [LED-0603]
D667  LED-BLUE0603  [LED-0603]
D668  LED-BLUE0603  [LED-0603]
D669  LED-BLUE0603  [LED-0603]
D670  LED-BLUE0603  [LED-0603]
D671  LED-BLUE0603  [LED-0603]
D672  LED-BLUE0603  [LED-0603]
D673  LED-BLUE0603  [LED-0603]
D674  LED-BLUE0603  [LED-0603]
D675  LED-BLUE0603  [LED-0603]
D676  LED-BLUE0603  [LED-0603]
D677  LED-BLUE0603  [LED-0603]
D678  LED-BLUE0603  [LED-0603]
D679  LED-BLUE0603  [LED-0603]
D680  LED-BLUE0603  [LED-0603]
D681  LED-BLUE0603  [LED-0603]
D682  LED-BLUE0603  [LED-0603]
D683  LED-BLUE0603  [LED-0603]
D684  LED-BLUE0603  [LED-0603]
D685  LED-BLUE0603  [LED-0603]
D686  LED-BLUE0603  [LED-0603]
D687  LED-BLUE0603  [LED-0603]
D688  LED-BLUE0603  [LED-0603]
D689  LED-BLUE0603  [LED-0603]
D690  LED-BLUE0603  [LED-0603]
D691  LED-BLUE0603  [LED-0603]
D692  LED-BLUE0603  [LED-0603]
D693  LED-BLUE0603  [LED-0603]
D694  LED-BLUE0603  [LED-0603]
D695  LED-BLUE0603  [LED-0603]
D696  LED-BLUE0603  [LED-0603]
D697  LED-BLUE0603  [LED-0603]
D698  LED-BLUE0603  [LED-0603]
D699  LED-BLUE0603  [LED-0603]
D700  LED-BLUE0603  [LED-0603]
D701  LED-BLUE0603  [LED-0603]
D702  LED-BLUE0603  [LED-0603]
D703  LED-BLUE0603  [LED-0603]
D704  LED-BLUE0603  [LED-0603]
D705  LED-BLUE0603  [LED-0603]
D706  LED-BLUE0603  [LED-0603]
D707  LED-BLUE0603  [LED-0603]
D708  LED-BLUE0603  [LED-0603]
D709  LED-BLUE0603  [LED-0603]
D710  LED-BLUE0603  [LED-0603]
D711  LED-BLUE0603  [LED-0603]
D712  LED-BLUE0603  [LED-0603]
D713  LED-BLUE0603  [LED-0603]
D714  LED-BLUE0603  [LED-0603]
D715  LED-BLUE0603  [LED-0603]
D716  LED-BLUE0603  [LED-0603]
D717  LED-BLUE0603  [LED-0603]
D718  LED-BLUE0603  [LED-0603]
D719  LED-BLUE0603  [LED-0603]
D720  LED-BLUE0603  [LED-0603]
D721  LED-BLUE0603  [LED-0603]
D722  LED-BLUE0603  [LED-0603]
D723  LED-BLUE0603  [LED-0603]
D724  LED-BLUE0603  [LED-0603]
D725  LED-BLUE0603  [LED-0603]
D726  LED-BLUE0603  [LED-0603]
D727  LED-BLUE0603  [LED-0603]
D728  LED-BLUE0603  [LED-0603]
D729  LED-BLUE0603  [LED-0603]
D730  LED-BLUE0603  [LED-0603]
D731  LED-BLUE0603  [LED-0603]
D732  LED-BLUE0603  [LED-0603]
D733  LED-BLUE0603  [LED-0603]
D734  LED-BLUE0603  [LED-0603]
D735  LED-BLUE0603  [LED-0603]
D736  LED-BLUE0603  [LED-0603]
D737  LED-BLUE0603  [LED-0603]
D738  LED-BLUE0603  [LED-0603]
D739  LED-BLUE0603  [LED-0603]
D740  LED-BLUE0603  [LED-0603]
D741  LED-BLUE0603  [LED-0603]
D742  LED-BLUE0603  [LED-0603]
D743  LED-BLUE0603  [LED-0603]
D744  LED-BLUE0603  [LED-0603]
D745  LED-BLUE0603  [LED-0603]
D746  LED-BLUE0603  [LED-0603]
D747  LED-BLUE0603  [LED-0603]
D748  LED-BLUE0603  [LED-0603]
D749  LED-BLUE0603  [LED-0603]
D750  LED-BLUE0603  [LED-0603]
D751  LED-BLUE0603  [LED-0603]
D752  LED-BLUE0603  [LED-0603]
D753  LED-BLUE0603  [LED-0603]
D754  LED-BLUE0603  [LED-0603]
D755  LED-BLUE0603  [LED-0603]
D756  LED-BLUE0603  [LED-0603]
D757  LED-BLUE0603  [LED-0603]
D758  LED-BLUE0603  [LED-0603]
D759  LED-BLUE0603  [LED-0603]
D760  LED-BLUE0603  [LED-0603]
D761  LED-BLUE0603  [LED-0603]
D762  LED-BLUE0603  [LED-0603]
D763  LED-BLUE0603  [LED-0603]
D764  LED-BLUE0603  [LED-0603]
D765  LED-BLUE0603  [LED-0603]
D766  LED-BLUE0603  [LED-0603]
D767  LED-BLUE0603  [LED-0603]
D768  LED-BLUE0603  [LED-0603]
D769  LED-BLUE0603  [LED-0603]
D770  LED-BLUE0603  [LED-0603]
D771  LED-BLUE0603  [LED-0603]
D772  LED-BLUE0603  [LED-0603]
D773  LED-BLUE0603  [LED-0603]
D774  LED-BLUE0603  [LED-0603]
D775  LED-BLUE0603  [LED-0603]
D776  LED-BLUE0603  [LED-0603]
D777  LED-BLUE0603  [LED-0603]
D778  LED-BLUE0603  [LED-0603]
D779  LED-BLUE0603  [LED-0603]
D780  LED-BLUE0603  [LED-0603]
D781  LED-BLUE0603  [LED-0603]
D782  LED-BLUE0603  [LED-0603]
D783  LED-BLUE0603  [LED-0603]
D784  LED-BLUE0603  [LED-0603]
D785  LED-BLUE0603  [LED-0603]
D786  LED-BLUE0603  [LED-0603]
D787  LED-BLUE0603  [LED-0603]
D788  LED-BLUE0603  [LED-0603]
D789  LED-BLUE0603  [LED-0603]
D790  LED-BLUE0603  [LED-0603]
D791  LED-BLUE0603  [LED-0603]
D792  LED-BLUE0603  [LED-0603]
D793  LED-BLUE0603  [LED-0603]
D794  LED-BLUE0603  [LED-0603]
D795  LED-BLUE0603  [LED-0603]
D796  LED-BLUE0603  [LED-0603]
D797  LED-BLUE0603  [LED-0603]
D798  LED-BLUE0603  [LED-0603]
D799  LED-BLUE0603  [LED-0603]
D800  LED-BLUE0603  [LED-0603]
D801  LED-BLUE0603  [LED-0603]
D802  LED-BLUE0603  [LED-0603]
D803  LED-BLUE0603  [LED-0603]
D804  LED-BLUE0603  [LED-0603]
D805  LED-BLUE0603  [LED-0603]
D806  LED-BLUE0603  [LED-0603]
D807  LED-BLUE0603  [LED-0603]
D808  LED-BLUE0603  [LED-0603]
D809  LED-BLUE0603  [LED-0603]
D810  LED-BLUE0603  [LED-0603]
D811  LED-BLUE0603  [LED-0603]
D812  LED-BLUE0603  [LED-0603]
D813  LED-BLUE0603  [LED-0603]
D814  LED-BLUE0603  [LED-0603]
D815  LED-BLUE0603  [LED-0603]
D816  LED-BLUE0603  [LED-0603]
D817  LED-BLUE0603  [LED-0603]
D818  LED-BLUE0603  [LED-0603]
D819  LED-BLUE0603  [LED-0603]
D820  LED-BLUE0603  [LED-0603]
D821  LED-BLUE0603  [LED-0603]
D822  LED-BLUE0603  [LED-0603]
D823  LED-BLUE0603  [LED-0603]
D824  LED-BLUE0603  [LED-0603]
D825  LED-BLUE0603  [LED-0603]
D826  LED-BLUE0603  [LED-0603]
D827  LED-BLUE0603  [LED-0603]
D828  LED-BLUE0603  [LED-0603]
D829  LED-BLUE0603  [LED-0603]
D830  LED-BLUE0603  [LED-0603]
D831  LED-BLUE0603  [LED-0603]
D832  LED-BLUE0603  [LED-0603]
D833  LED-BLUE0603  [LED-0603]
D834  LED-BLUE0603  [LED-0603]
D835  LED-BLUE0603  [LED-0603]
D836  LED-BLUE0603  [LED-0603]
D837  LED-BLUE0603  [LED-0603]
D838  LED-BLUE0603  [LED-0603]
D839  LED-BLUE0603  [LED-0603]
D840  LED-BLUE0603  [LED-0603]
D841  LED-BLUE0603  [LED-0603]
D842  LED-BLUE0603  [LED-0603]
D843  LED-BLUE0603  [LED-0603]
D844  LED-BLUE0603  [LED-0603]
D845  LED-BLUE0603  [LED-0603]
D846  LED-BLUE0603  [LED-0603]
D847  LED-BLUE0603  [LED-0603]
D848  LED-BLUE0603  [LED-0603]
D849  LED-BLUE0603  [LED-0603]
D850  LED-BLUE0603  [LED-0603]
D851  LED-BLUE0603  [LED-0603]
D852  LED-BLUE0603  [LED-0603]
D853  LED-BLUE0603  [LED-0603]
D854  LED-BLUE0603  [LED-0603]
D855  LED-BLUE0603  [LED-0603]
D856  LED-BLUE0603  [LED-0603]
D857  LED-BLUE0603  [LED-0603]
D858  LED-BLUE0603  [LED-0603]
D859  LED-BLUE0603  [LED-0603]
D860  LED-BLUE0603  [LED-0603]
D861  LED-BLUE0603  [LED-0603]
D862  LED-BLUE0603  [LED-0603]
D863  LED-BLUE0603  [LED-0603]
D864  LED-BLUE0603  [LED-0603]
D865  LED-BLUE0603  [LED-0603]
D866  LED-BLUE0603  [LED-0603]
D867  LED-BLUE0603  [LED-0603]
D868  LED-BLUE0603  [LED-0603]
D869  LED-BLUE0603  [LED-0603]
D870  LED-BLUE0603  [LED-0603]
D871  LED-BLUE0603  [LED-0603]
D872  LED-BLUE0603  [LED-0603]
D873  LED-BLUE0603  [LED-0603]
D874  LED-BLUE0603  [LED-0603]
D875  LED-BLUE0603  [LED-0603]
D876  LED-BLUE0603  [LED-0603]
D877  LED-BLUE0603  [LED-0603]
D878  LED-BLUE0603  [LED-0603]
D879  LED-BLUE0603  [LED-0603]
D880  LED-BLUE0603  [LED-0603]
D881  LED-BLUE0603  [LED-0603]
D882  LED-BLUE0603  [LED-0603]
D883  LED-BLUE0603  [LED-0603]
D884  LED-BLUE0603  [LED-0603]
D885  LED-BLUE0603  [LED-0603]
D886  LED-BLUE0603  [LED-0603]
D887  LED-BLUE0603  [LED-0603]
D888  LED-BLUE0603  [LED-0603]
D889  LED-BLUE0603  [LED-0603]
D890  LED-BLUE0603  [LED-0603]
D891  LED-BLUE0603  [LED-0603]
D892  LED-BLUE0603  [LED-0603]
D893  LED-BLUE0603  [LED-0603]
D894  LED-BLUE0603  [LED-0603]
D895  LED-BLUE0603  [LED-0603]
D896  LED-BLUE0603  [LED-0603]
D897  LED-BLUE0603  [LED-0603]
D898  LED-BLUE0603  [LED-0603]
D899  LED-BLUE0603  [LED-0603]
D900  LED-BLUE0603  [LED-0603]
D901  LED-BLUE0603  [LED-0603]
D902  LED-BLUE0603  [LED-0603]
D903  LED-BLUE0603  [LED-0603]
D904  LED-BLUE0603  [LED-0603]
D905  LED-BLUE0603  [LED-0603]
D906  LED-BLUE0603  [LED-0603]
D907  LED-BLUE0603  [LED-0603]
D908  LED-BLUE0603  [LED-0603]
D909  LED-BLUE0603  [LED-0603]
D910  LED-BLUE0603  [LED-0603]
D911  LED-BLUE0603  [LED-0603]
D912  LED-BLUE0603  [LED-0603]
D913  LED-BLUE0603  [LED-0603]
D914  LED-BLUE0603  [LED-0603]
D915  LED-BLUE0603  [LED-0603]
D916  LED-BLUE0603  [LED-0603]
D917  LED-BLUE0603  [LED-0603]
D918  LED-BLUE0603  [LED-0603]
D919  LED-BLUE0603  [LED-0603]
D920  LED-BLUE0603  [LED-0603]
D921  LED-BLUE0603  [LED-0603]
D922  LED-BLUE0603  [LED-0603]
D923  LED-BLUE0603  [LED-0603]
D924  LED-BLUE0603  [LED-0603]
D925  LED-BLUE0603  [LED-0603]
D926  LED-BLUE0603  [LED-0603]
D927  LED-BLUE0603  [LED-0603]
D928  LED-BLUE0603  [LED-0603]
D929  LED-BLUE0603  [LED-0603]
D930  LED-BLUE0603  [LED-0603]
D931  LED-BLUE0603  [LED-0603]
D932  LED-BLUE0603  [LED-0603]
D933  LED-BLUE0603  [LED-0603]
D934  LED-BLUE0603  [LED-0603]
D935  LED-BLUE0603  [LED-0603]
D936  LED-BLUE0603  [LED-0603]
D937  LED-BLUE0603  [LED-0603]
D938  LED-BLUE0603  [LED-0603]
D939  LED-BLUE0603  [LED-0603]
D940  LED-BLUE0603  [LED-0603]
D941  LED-BLUE0603  [LED-0603]
D942  LED-BLUE0603  [LED-0603]
D943  LED-BLUE0603  [LED-0603]
D944  LED-BLUE0603  [LED-0603]
D945  LED-BLUE0603  [LED-0603]
D946  LED-BLUE0603  [LED-0603]
D947  LED-BLUE0603  [LED-0603]
D948  LED-BLUE0603  [LED-0603]
D949  LED-BLUE0603  [LED-0603]
D950  LED-BLUE0603  [LED-0603]
D951  LED-BLUE0603  [LED-0603]
D952  LED-BLUE0603  [LED-0603]
D953  LED-BLUE0603  [LED-0603]
D954  LED-BLUE0603  [LED-0603]
D955  LED-BLUE0603  [LED-0603]
D956  LED-BLUE0603  [LED-0603]
D957  LED-BLUE0603  [LED-0603]
D958  LED-BLUE0603  [LED-0603]
D959  LED-BLUE0603  [LED-0603]
D960  LED-BLUE0603  [LED-0603]
D961  LED-BLUE0603  [LED-0603]
D962  LED-BLUE0603  [LED-0603]
D963  LED-BLUE0603  [LED-0603]
D964  LED-BLUE0603  [LED-0603]
D965  LED-BLUE0603  [LED-0603]
D966  LED-BLUE0603  [LED-0603]
D967  LED-BLUE0603  [LED-0603]
D968  LED-BLUE0603  [LED-0603]
D969  LED-BLUE0603  [LED-0603]
D970  LED-BLUE0603  [LED-0603]
D971  LED-BLUE0603  [LED-0603]
D972  LED-BLUE0603  [LED-0603]
D973  LED-BLUE0603  [LED-0603]
D974  LED-BLUE0603  [LED-0603]
D975  LED-BLUE0603  [LED-0603]
D976  LED-BLUE0603  [LED-0603]
D977  LED-BLUE0603  [LED-0603]
D978  LED-BLUE0603  [LED-0603]
D979  LED-BLUE0603  [LED-0603]
D980  LED-BLUE0603  [LED-0603]
D981  LED-BLUE0603  [LED-0603]
D982  LED-BLUE0603  [LED-0603]
D983  LED-BLUE0603  [LED-0603]
D984  LED-BLUE0603  [LED-0603]
D985  LED-BLUE0603  [LED-0603]
D986  LED-BLUE0603  [LED-0603]
D987  LED-BLUE0603  [LED-0603]
D988  LED-BLUE0603  [LED-0603]
D989  LED-BLUE0603  [LED-0603]
D990  LED-BLUE0603  [LED-0603]
D991  LED-BLUE0603  [LED-0603]
D992  LED-BLUE0603  [LED-0603]
D993  LED-BLUE0603  [LED-0603]
D994  LED-BLUE0603  [LED-0603]
D995  LED-BLUE0603  [LED-0603]
D996  LED-BLUE0603  [LED-0603]
D997  LED-BLUE0603  [LED-0603]
D998  LED-BLUE0603  [LED-0603]
D999  LED-BLUE0603  [LED-0603]
D1000  LED-BLUE0603  [LED-0603]
D1001  LED-BLUE0603  [LED-0603]
D1002  LED-BLUE0603  [LED-0603]
D1003  LED-BLUE0603  [LED-0603]
D1004  LED-BLUE0603  [LED-0603]
D1005  LED-BLUE0603  [LED-0603]
D1006  LED-BLUE0603  [LED-0603]
D1007  LED-BLUE0603  [LED-0603]
D1008  LED-BLUE0603  [LED-0603]
D1009  LED-BLUE0603  [LED-0603]
D1010  LED-BLUE0603  [LED-0603]
D1011  LED-BLUE0603  [LED-0603]
D1012  LED-BLUE0603  [LED-0603]
D1013  LED-BLUE0603  [LED-0603]
D1014  LED-BLUE0603  [LED-0603]
D1015  LED-BLUE0603  [LED-0603]
D1016  LED-BLUE0603  [LED-0603]
D1017  LED-BLUE0603  [LED-0603]
D1018  LED-BLUE0603  [LED-0603]
D1019  LED-BLUE0603  [LED-0603]
D1020  LED-BLUE0603  [LED-0603]
D1021  LED-BLUE0603  [LED-0603]
D1022  LED-BLUE0603  [LED-0603]
D1023  LED-BLUE0603  [LED-0603]
D1024  LED-BLUE0603  [LED-0603]
D1025  LED-BLUE0603  [LED-0603]
D1026  LED-BLUE0603  [LED-0603]
D1027  LED-BLUE0603  [LED-0603]
D1028  3A/10V/280mV  DIODE-SCHOTTKY-BAT60A  [SOD-323]
F1  1A  RESISTOR0805-RES  [0805]
IC1  TLC59283DBQR  [DBQ24_TEX]
IC2  TLC59283DBQR  [DBQ24_TEX]
IC3  TLC59283DBQR  [DBQ24_TEX]
IC4  TLC59283DBQR  [DBQ24_TEX]
IC5  TLC59283DBQR  [DBQ24_TEX]
IC6  TLC59283DBQR  [DBQ24_TEX]
IC7  TLC59283DBQR  [DBQ24_TEX]
IC8  TLC59283DBQR  [DBQ24_TEX]
IC9  TLC59283DBQR  [DBQ24_TEX]
IC10  TLC59283DBQR  [DBQ24_TEX]
IC11  TLC59283DBQR  [DBQ24_TEX]
IC12  TLC59283DBQR  [DBQ24_TEX]
IC13  TLC59283DBQR  [DBQ24_TEX]
IC14  TLC59283DBQR  [DBQ24_TEX]
IC15  TLC59283DBQR  [DBQ24_TEX]
IC16  TLC59283DBQR  [DBQ24_TEX]
IC17  TLC59283DBQR  [DBQ24_TEX]
IC18  TLC59283DBQR  [DBQ24_TEX]
IC19  TLC59283DBQR  [DBQ24_TEX]
IC20  TLC59283DBQR  [DBQ24_TEX]
IC21  TLC59283DBQR  [DBQ24_TEX]
IC22  TLC59283DBQR  [DBQ24_TEX]
IC23  TLC59283DBQR  [DBQ24_TEX]
IC24  TLC59283DBQR  [DBQ24_TEX]
IC25  TLC59283DBQR  [DBQ24_TEX]
IC26  TLC59283DBQR  [DBQ24_TEX]
IC27  TLC59283DBQR  [DBQ24_TEX]
IC28  TLC59283DBQR  [DBQ24_TEX]
IC29  TLC59283DBQR  [DBQ24_TEX]
IC30  TLC59283DBQR  [DBQ24_TEX]
IC31  TLC59283DBQR  [DBQ24_TEX]
IC32  TLC59283DBQR  [DBQ24_TEX]
IC33  TLC59283DBQR  [DBQ24_TEX]
IC34  TLC59283DBQR  [DBQ24_TEX]
IC35  TLC59283DBQR  [DBQ24_TEX]
IC36  TLC59283DBQR  [DBQ24_TEX]
IC37  TLC59283DBQR  [DBQ24_TEX]
IC38  TLC59283DBQR  [DBQ24_TEX]
IC39  TLC59283DBQR  [DBQ24_TEX]
IC40  TLC59283DBQR  [DBQ24_TEX]
IC41  TLC59283DBQR  [DBQ24_TEX]
IC42  TLC59283DBQR  [DBQ24_TEX]
IC43  TLC59283DBQR  [DBQ24_TEX]
IC44  TLC59283DBQR  [DBQ24_TEX]
IC45  TLC59283DBQR  [DBQ24_TEX]
IC46  TLC59283DBQR  [DBQ24_TEX]
IC47  TLC59283DBQR  [DBQ24_TEX]
IC48  TLC59283DBQR  [DBQ24_TEX]
IC49  TLC59283DBQR  [DBQ24_TEX]
IC50  TLC59283DBQR  [DBQ24_TEX]
IC51  TLC59283DBQR  [DBQ24_TEX]
IC52  TLC59283DBQR  [DBQ24_TEX]
IC53  TLC59283DBQR  [DBQ24_TEX]
IC54  TLC59283DBQR  [DBQ24_TEX]
IC55  TLC59283DBQR  [DBQ24_TEX]
IC56  TLC59283DBQR  [DBQ24_TEX]
IC57  TLC59283DBQR  [DBQ24_TEX]
IC58  TLC59283DBQR  [DBQ24_TEX]
IC59  TLC59283DBQR  [DBQ24_TEX]
IC60  TLC59283DBQR  [DBQ24_TEX]
IC61  TLC59283DBQR  [DBQ24_TEX]
IC62  TLC59283DBQR  [DBQ24_TEX]
IC63  TLC59283DBQR  [DBQ24_TEX]
IC64  TLC59283DBQR  [DBQ24_TEX]
J1  MICROSD-PUSH-OUT  [MICROSD-PUSH-OUT]
J2  10033527-N3112MLF  [AMPHENOL_10033527-N3112MLF]
JP1  PINHD-1X2  [1X02]
JP2  SERIAL_DEBUG  PINHEAD_PINHD-1X4  [PINHEAD_1X04]
L1  ED16  [ED16]
P1  HEADER5  [HEADER5]
P2  HEADER5  [HEADER5]
R1  4.7k  RESISTOR0805-RES  [0805]
R2  10K  RESISTOR0805-RES  [0805]
R3  10K  RESISTOR0805-RES  [0805]
R4  22  RESISTOR0805-RES  [0805]
R5  22  RESISTOR0805-RES  [0805]
R6  10K  RESISTOR0805-RES  [0805]
R7  3.3k  RESISTOR0805-RES  [0805]
R8  1k  RESISTOR0805-RES  [0805]
R9  1k  RESISTOR0805-RES  [0805]
R10  10k  RESISTOR0805-RES  [0805]
R11  33k  RESISTOR0805-RES  [0805]
R12  10k  10KOHM-0603-1/10W-1%  [0603]
R13  10k  10KOHM-0603-1/10W-1%  [0603]
R14  10k  10KOHM-0603-1/10W-1%  [0603]
R15  10k  10KOHM-0603-1/10W-1%  [0603]
R16  10k  10KOHM-0603-1/10W-1%  [0603]
R17  10k  10KOHM-0603-1/10W-1%  [0603]
R18  10k  10KOHM-0603-1/10W-1%  [0603]
R19  10k  10KOHM-0603-1/10W-1%  [0603]
R20  10k  10KOHM-0603-1/10W-1%  [0603]
R21  10k  10KOHM-0603-1/10W-1%  [0603]
R22  10k  10KOHM-0603-1/10W-1%  [0603]
R23  10k  10KOHM-0603-1/10W-1%  [0603]
R24  10k  10KOHM-0603-1/10W-1%  [0603]
R25  10k  10KOHM-0603-1/10W-1%  [0603]
R26  10k  10KOHM-0603-1/10W-1%  [0603]
R27  10k  10KOHM-0603-1/10W-1%  [0603]
R28  10k  10KOHM-0603-1/10W-1%  [0603]
R29  10k  10KOHM-0603-1/10W-1%  [0603]
R30  10k  10KOHM-0603-1/10W-1%  [0603]
R31  10k  10KOHM-0603-1/10W-1%  [0603]
R32  10k  10KOHM-0603-1/10W-1%  [0603]
R33  10k  10KOHM-0603-1/10W-1%  [0603]
R34  10k  10KOHM-0603-1/10W-1%  [0603]
R35  10k  10KOHM-0603-1/10W-1%  [0603]
R36  10k  10KOHM-0603-1/10W-1%  [0603]
R37  10k  10KOHM-0603-1/10W-1%  [0603]
R38  10k  10KOHM-0603-1/10W-1%  [0603]
R39  10k  10KOHM-0603-1/10W-1%  [0603]
R40  10k  10KOHM-0603-1/10W-1%  [0603]
R41  10k  10KOHM-0603-1/10W-1%  [0603]
R42  10k  10KOHM-0603-1/10W-1%  [0603]
R43  10k  10KOHM-0603-1/10W-1%  [0603]
R44  10k  10KOHM-0603-1/10W-1%  [0603]
R45  10k  10KOHM-0603-1/10W-1%  [0603]
R46  10k  10KOHM-0603-1/10W-1%  [0603]
R47  10k  10KOHM-0603-1/10W-1%  [0603]
R48  10k  10KOHM-0603-1/10W-1%  [0603]
R49  10k  10KOHM-0603-1/10W-1%  [0603]
R50  10k  10KOHM-0603-1/10W-1%  [0603]
R51  10k  10KOHM-0603-1/10W-1%  [0603]
R52  10k  10KOHM-0603-1/10W-1%  [0603]
R53  10k  10KOHM-0603-1/10W-1%  [0603]
R54  10k  10KOHM-0603-1/10W-1%  [0603]
R55  10k  10KOHM-0603-1/10W-1%  [0603]
R56  10k  10KOHM-0603-1/10W-1%  [0603]
R57  10k  10KOHM-0603-1/10W-1%  [0603]
R58  10k  10KOHM-0603-1/10W-1%  [0603]
R59  10k  10KOHM-0603-1/10W-1%  [0603]
R60  10k  10KOHM-0603-1/10W-1%  [0603]
R61  10k  10KOHM-0603-1/10W-1%  [0603]
R62  10k  10KOHM-0603-1/10W-1%  [0603]
R63  10k  10KOHM-0603-1/10W-1%  [0603]
R64  10k  10KOHM-0603-1/10W-1%  [0603]
R65  10k  10KOHM-0603-1/10W-1%  [0603]
R66  10k  10KOHM-0603-1/10W-1%  [0603]
R67  10k  10KOHM-0603-1/10W-1%  [0603]
R68  10k  10KOHM-0603-1/10W-1%  [0603]
R69  10k  10KOHM-0603-1/10W-1%  [0603]
R70  10k  10KOHM-0603-1/10W-1%  [0603]
R71  10k  10KOHM-0603-1/10W-1%  [0603]
R72  10k  10KOHM-0603-1/10W-1%  [0603]
R73  10k  10KOHM-0603-1/10W-1%  [0603]
R74  10k  10KOHM-0603-1/10W-1%  [0603]
R75  10k  10KOHM-0603-1/10W-1%  [0603]
SW1  PTS636_SM25F_SMTR_LFS  [SW2_PTS636_SM25F_SMTR_LFS_CNK]
SW2  PTS636_SM25F_SMTR_LFS  [SW2_PTS636_SM25F_SMTR_LFS_CNK]
U2  ESP32-S2-WROVER  [MODULE_ESP32-S2-WROVER]
U3  ME6211  [SOT23-5]
U5  XL4015  [TO263-5L_DIO]